# EAGLE design CS-HAT V2 (EAGLE 7.2.0)
REVISION: 1

## Sheet 1 of 4
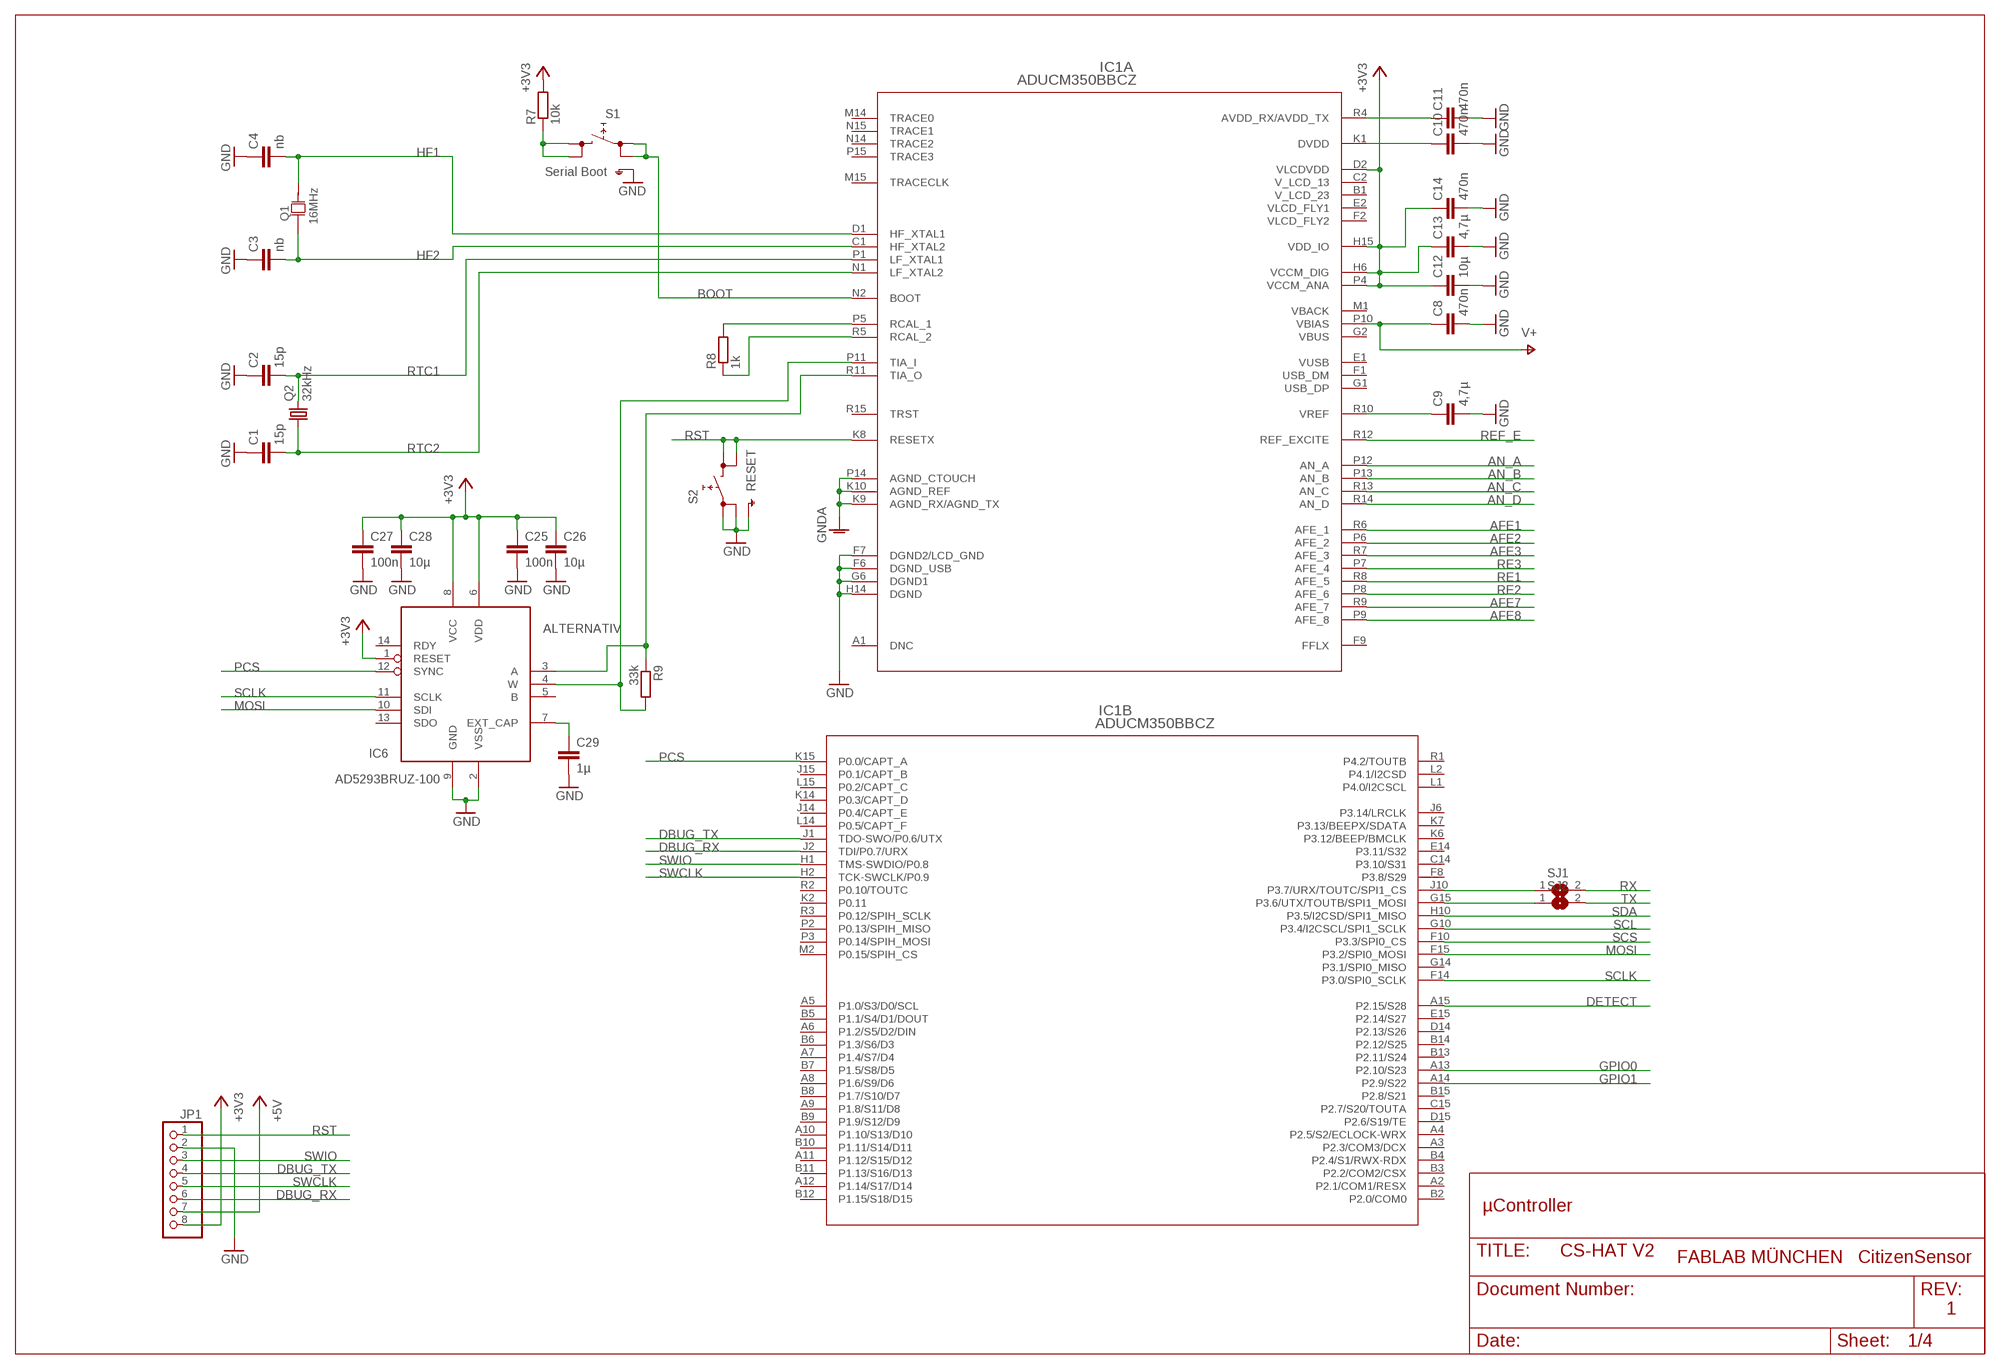
[diagram p0: schematic, sheet 1]

### Parts
C1  15p  C-EUC0805  [C0805]
C2  15p  C-EUC0805  [C0805]
C3  nb  C-EUC0805  [C0805]
C4  nb  C-EUC0805  [C0805]
C8  470n  C-EUC0805  [C0805]
C9  4,7µ  C-EUC1206  [C1206]
C10  470n  C-EUC0805  [C0805]
C11  470n  C-EUC0805  [C0805]
C12  10µ  C-EUC1206  [C1206]
C13  4,7µ  C-EUC1206  [C1206]
C14  470n  C-EUC0805  [C0805]
C25  100n  C-EUC0805  [C0805]
C26  10µ  C-EUC1206  [C1206]
C27  100n  C-EUC0805  [C0805]
C28  10µ  C-EUC1206  [C1206]
C29  1µ  C-EUC1206  [C1206]
IC1  ADUCM350BBCZ  [BC_120_3]
IC6  AD5293BRUZ-100  AD5293BRUZ  [TSSOP14]
JP1  PINHD-1X8S  [1X08S]
Q1  16MHz  JXS53  [JXS53]
Q2  32kHz  FC-12M  [FC-12M]
R7  10k  R-EU_R0805  [R0805]
R8  1k  R-EU_R0805  [R0805]
R9  33k  R-EU_R0805  [R0805]
S1  Serial Boot  SKHMPSE010  [SKHMPXE010]
S2  RESET  SKHMPSE010  [SKHMPXE010]
SJ1  SJ  [SJ]
SJ2  SJ  [SJ]

### Nets
+3V3: C12.1 C13.1 C14.1 C25.1 C26.1 C27.1 C28.1 IC1.D2(A:VLCDVDD) IC1.H6(A:VCCM_DIG) IC1.H15(A:VDD_IO) IC1.P4(A:VCCM_ANA) IC6.1(RESET) IC6.6(VDD) IC6.8(VCC) JP1.8 R7.2 ; also sheet 2,3
+5V: JP1.7 ; also sheet 2
AFE1: IC1.R6(A:AFE_1) ; also sheet 2
AFE2: IC1.P6(A:AFE_2)
AFE3: IC1.R7(A:AFE_3) ; also sheet 2
AFE7: IC1.R9(A:AFE_7) ; also sheet 3
AFE8: IC1.P9(A:AFE_8) ; also sheet 3
AN_A: IC1.P12(A:AN_A) ; also sheet 3
AN_B: IC1.P13(A:AN_B)
AN_C: IC1.R13(A:AN_C)
AN_D: IC1.R14(A:AN_D) ; also sheet 3
BOOT: IC1.N2(A:BOOT) S1.1(1.1) S1.2(1.2) ; also sheet 2
DBUG_RX: IC1.J2(B:TDI/P0.7/URX) JP1.6
DBUG_TX: IC1.J1(B:TDO-SWO/P0.6/UTX) JP1.4
DETECT: IC1.A15(B:P2.15/S28) ; also sheet 2
GND: C1.1 C2.1 C3.1 C4.1 C8.2 C9.2 C10.2 C11.2 C12.2 C13.2 C14.2 C25.2 C26.2 C27.2 C28.2 C29.2 IC1.F6(A:DGND_USB) IC1.F7(A:DGND2/LCD_GND) IC1.G6(A:DGND1) IC1.H14(A:DGND) IC6.2(VSS) IC6.9(GND) JP1.2 S1.5(SH) S2.1(1.1) S2.2(1.2) S2.5(SH) ; also sheet 2,3
GNDA: IC1.K9(A:AGND_RX/AGND_TX) IC1.K10(A:AGND_REF) IC1.P14(A:AGND_CTOUCH) ; also sheet 2,3
GPIO0: IC1.A13(B:P2.10/S23) ; also sheet 2
GPIO1: IC1.A14(B:P2.9/S22) ; also sheet 2
HF1: C4.2 IC1.D1(A:HF_XTAL1) Q1.3
HF2: C3.2 IC1.C1(A:HF_XTAL2) Q1.1
MOSI: IC1.F15(B:P3.2/SPI0_MOSI) IC6.10(SDI) ; also sheet 3
N$3: IC1.J10(B:P3.7/URX/TOUTC/SPI1_CS) SJ1.1
N$4: IC1.G15(B:P3.6/UTX/TOUTB/SPI1_MOSI) SJ2.1
N$9: R7.1 S1.3(2.1) S1.4(2.2)
N$10: C29.1 IC6.7(EXT_CAP)
N$11: IC1.P5(A:RCAL_1) R8.2
N$12: IC1.R5(A:RCAL_2) R8.1
N$13: IC1.P11(A:TIA_I) IC6.4(W) R9.2
N$14: IC1.R11(A:TIA_O) IC6.3(A) R9.1
N$16: C9.1 IC1.R10(A:VREF)
N$18: C10.1 IC1.K1(A:DVDD)
N$19: C11.1 IC1.R4(A:AVDD_RX/AVDD_TX)
PCS: IC1.K15(B:P0.0/CAPT_A) IC6.12(SYNC)
RE1: IC1.R8(A:AFE_5) ; also sheet 2,3
RE2: IC1.P8(A:AFE_6) ; also sheet 2
RE3: IC1.P7(A:AFE_4) ; also sheet 2
REF_E: IC1.R12(A:REF_EXCITE)
RST: IC1.K8(A:RESETX) JP1.1 S2.3(2.1) S2.4(2.2) ; also sheet 2
RTC1: C2.2 IC1.P1(A:LF_XTAL1) Q2.2
RTC2: C1.2 IC1.N1(A:LF_XTAL2) Q2.1
RX: SJ1.2 ; also sheet 2
SCL: IC1.G10(B:P3.4/I2CSCL/SPI1_SCLK) ; also sheet 2,3
SCLK: IC1.F14(B:P3.0/SPI0_SCLK) IC6.11(SCLK) ; also sheet 3
SCS: IC1.F10(B:P3.3/SPI0_CS) ; also sheet 3
SDA: IC1.H10(B:P3.5/I2CSD/SPI1_MISO) ; also sheet 2,3
SWCLK: IC1.H2(B:TCK-SWCLK/P0.9) JP1.5
SWIO: IC1.H1(B:TMS-SWDIO/P0.8) JP1.3
TX: SJ2.2 ; also sheet 2
V+: C8.1 IC1.P10(A:VBIAS) ; also sheet 3
Unconnected: IC1.A1(A:DNC) IC1.A2(B:P2.1/COM1/RESX) IC1.A3(B:P2.3/COM3/DCX) IC1.A4(B:P2.5/S2/ECLOCK-WRX) IC1.A5(B:P1.0/S3/D0/SCL) IC1.A6(B:P1.2/S5/D2/DIN) IC1.A7(B:P1.4/S7/D4) IC1.A8(B:P1.6/S9/D6) IC1.A9(B:P1.8/S11/D8) IC1.A10(B:P1.10/S13/D10) IC1.A11(B:P1.12/S15/D12) IC1.A12(B:P1.14/S17/D14) IC1.B1(A:V_LCD_23) IC1.B2(B:P2.0/COM0) IC1.B3(B:P2.2/COM2/CSX) IC1.B4(B:P2.4/S1/RWX-RDX) IC1.B5(B:P1.1/S4/D1/DOUT) IC1.B6(B:P1.3/S6/D3) IC1.B7(B:P1.5/S8/D5) IC1.B8(B:P1.7/S10/D7) IC1.B9(B:P1.9/S12/D9) IC1.B10(B:P1.11/S14/D11) IC1.B11(B:P1.13/S16/D13) IC1.B12(B:P1.15/S18/D15) IC1.B13(B:P2.11/S24) IC1.B14(B:P2.12/S25) IC1.B15(B:P2.8/S21) IC1.C2(A:V_LCD_13) IC1.C14(B:P3.10/S31) IC1.C15(B:P2.7/S20/TOUTA) IC1.D14(B:P2.13/S26) IC1.D15(B:P2.6/S19/TE) IC1.E1(A:VUSB) IC1.E2(A:VLCD_FLY1) IC1.E14(B:P3.11/S32) IC1.E15(B:P2.14/S27) IC1.F1(A:USB_DM) IC1.F2(A:VLCD_FLY2) IC1.F8(B:P3.8/S29) IC1.F9(A:FFLX) IC1.G1(A:USB_DP) IC1.G2(A:VBUS) IC1.G14(B:P3.1/SPI0_MISO) IC1.J6(B:P3.14/LRCLK) IC1.J14(B:P0.4/CAPT_E) IC1.J15(B:P0.1/CAPT_B) IC1.K2(B:P0.11) IC1.K6(B:P3.12/BEEP/BMCLK) IC1.K7(B:P3.13/BEEPX/SDATA) IC1.K14(B:P0.3/CAPT_D) IC1.L1(B:P4.0/I2CSCL) IC1.L2(B:P4.1/I2CSD) IC1.L14(B:P0.5/CAPT_F) IC1.L15(B:P0.2/CAPT_C) IC1.M1(A:VBACK) IC1.M2(B:P0.15/SPIH_CS) IC1.M14(A:TRACE0) IC1.M15(A:TRACECLK) IC1.N14(A:TRACE2) IC1.N15(A:TRACE1) IC1.P2(B:P0.13/SPIH_MISO) IC1.P3(B:P0.14/SPIH_MOSI) IC1.P15(A:TRACE3) IC1.R1(B:P4.2/TOUTB) IC1.R2(B:P0.10/TOUTC) IC1.R3(B:P0.12/SPIH_SCLK) IC1.R15(A:TRST) IC6.5(B) IC6.13(SDO) IC6.14(RDY)

### Notes on the sheet
- ALTERNATIV
- µController
- FABLAB MÜNCHEN   CitizenSensor

## Sheet 2 of 4
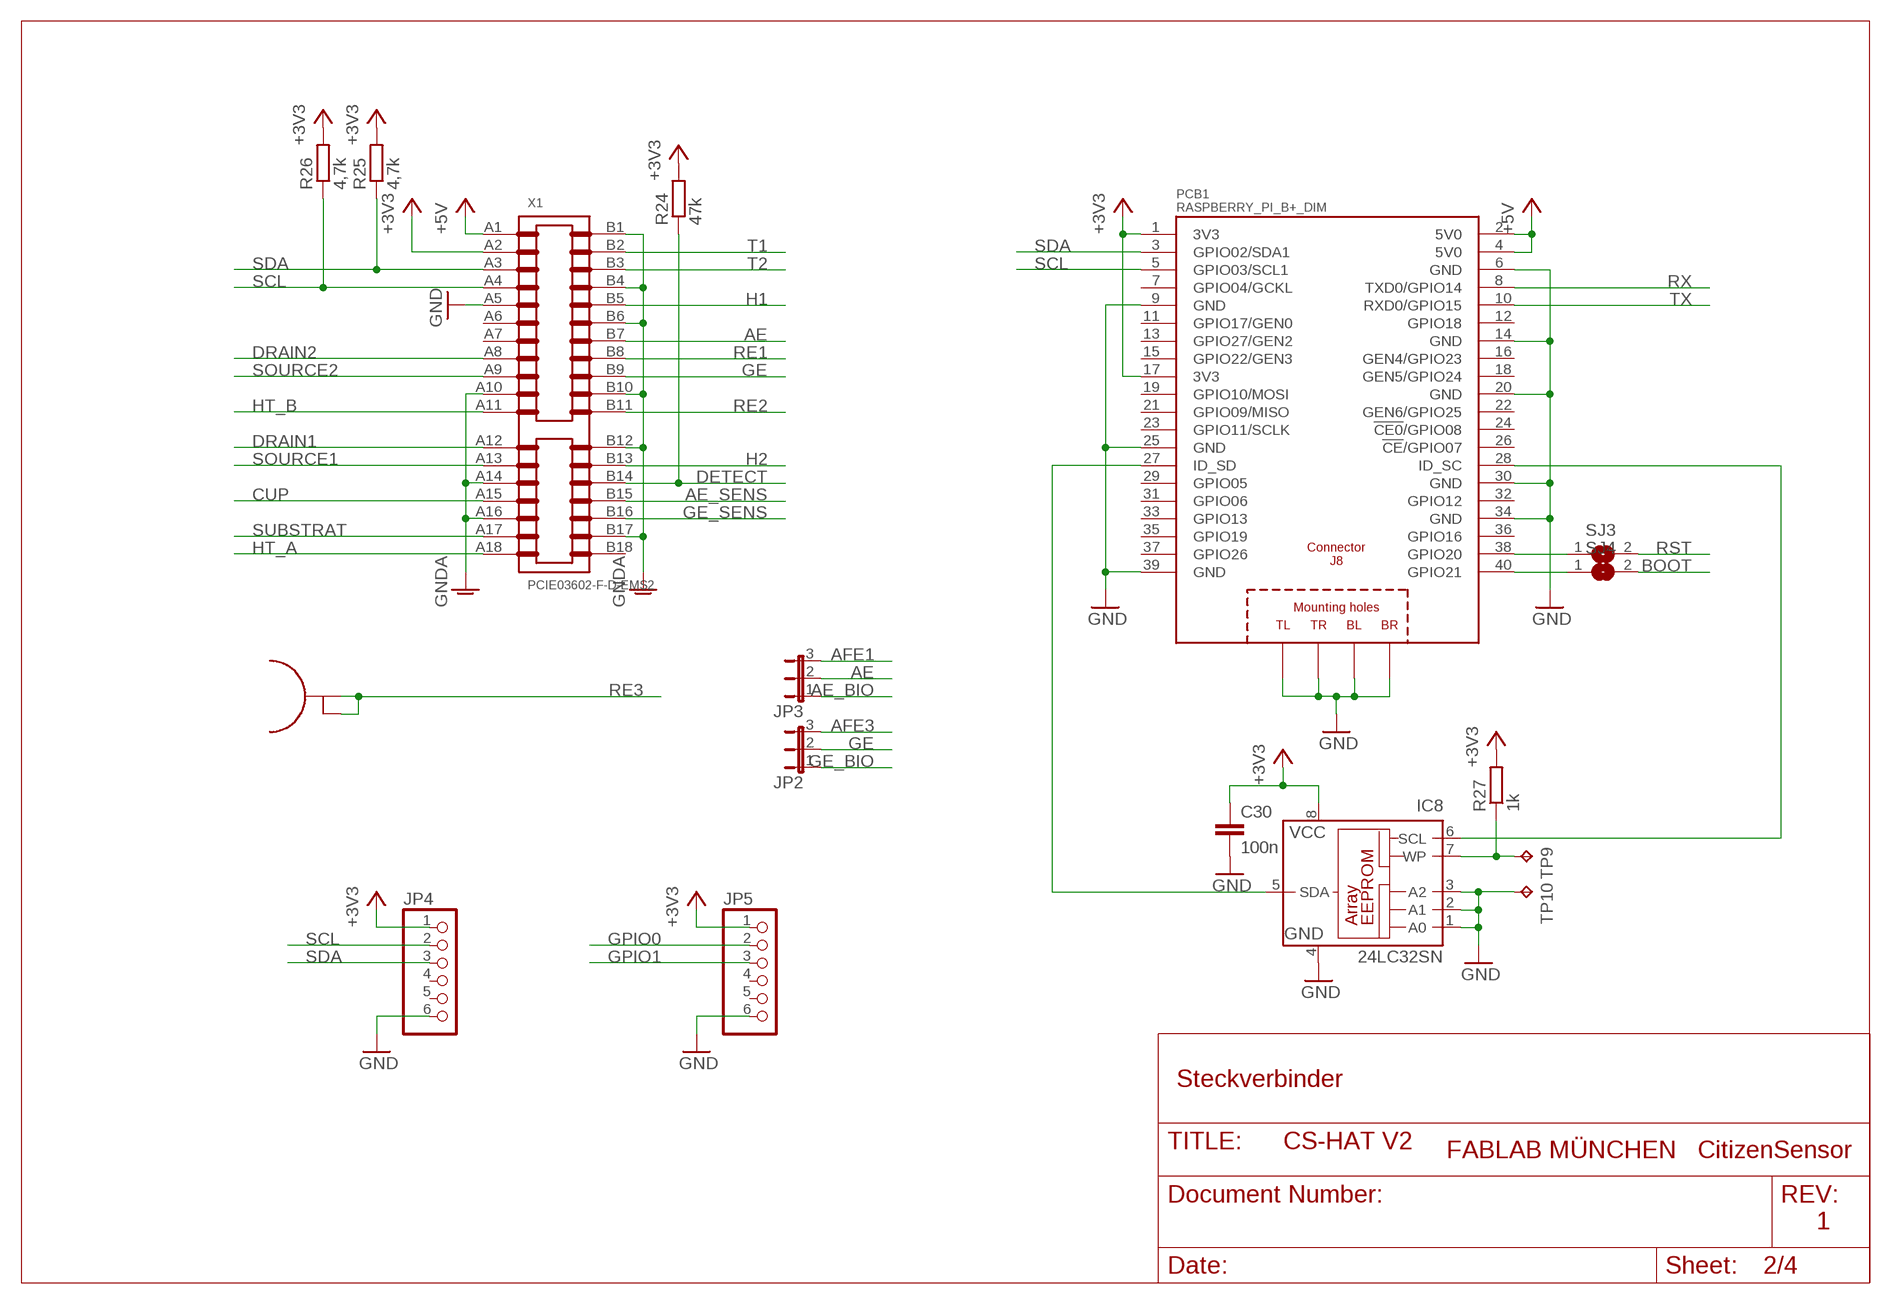
[diagram p1: schematic, sheet 2]

### Parts
C30  100n  C-EUC0805  [C0805]
IC8  24LC32SN  24C04SN  [SO-08]
JP2  JP2ES  [JP2S]
JP3  JP2ES  [JP2S]
JP4  PINHD-1X6S  [1X06S]
JP5  PINHD-1X6S  [1X06S]
PCB1  RASPBERRY_PI_B+_DIM  [RASPBERRY_PI_BPLUS_DIM]
R24  47k  R-EU_R0805  [R0805]
R25  4,7k  R-EU_R0805  [R0805]
R26  4,7k  R-EU_R0805  [R0805]
R27  1k  R-EU_R0805  [R0805]
SJ3  SJ  [SJ]
SJ4  SJ  [SJ]
TP8  TESTPLUG2MM  [TESTPLUG2MM]
TP9  TPB2,54  [B2,54]
TP10  TPB2,54  [B2,54]
X1  PCIE03602-F-D-EMS2  [PCIE-036-02-F-D-EMS2]

### Nets
+3V3: C30.1 IC8.8(VCC) JP4.1 JP5.1 PCB1.1(3V3) PCB1.17(3V3) R24.2 R25.2 R26.2 R27.2 X1.A2 ; also sheet 1,3
+5V: PCB1.2(5V0) PCB1.4(5V0) X1.A1 ; also sheet 1
AE: JP3.2 X1.B7
AE_BIO: JP3.1 ; also sheet 3
AE_SENS: X1.B15 ; also sheet 3
AFE1: JP3.3 ; also sheet 1
AFE3: JP2.3 ; also sheet 1
BOOT: SJ4.2 ; also sheet 1
CUP: X1.A15
DETECT: R24.1 X1.B14 ; also sheet 1
DRAIN1: X1.A12
DRAIN2: X1.A8
GE: JP2.2 X1.B9
GE_BIO: JP2.1 ; also sheet 3
GE_SENS: X1.B16 ; also sheet 3
GND: C30.2 IC8.1(A0) IC8.2(A1) IC8.3(A2) IC8.4(GND) JP4.6 JP5.6 PCB1.6(GND) PCB1.9(GND) PCB1.14(GND) PCB1.20(GND) PCB1.25(GND) PCB1.30(GND) PCB1.34(GND) PCB1.39(GND) PCB1.PE_BL(BL) PCB1.PE_BR(BR) PCB1.PE_TL(TL) PCB1.PE_TR(TR) TP10.TP X1.A5 ; also sheet 1,3
GNDA: X1.A10 X1.A14 X1.A16 X1.B1 X1.B4 X1.B6 X1.B10 X1.B12 X1.B17 ; also sheet 1,3
GPIO0: JP5.2 ; also sheet 1
GPIO1: JP5.3 ; also sheet 1
H1: X1.B5 ; also sheet 3
H2: X1.B13
HT_A: X1.A18
HT_B: X1.A11
N$25: PCB1.40(GPIO21) SJ4.1
N$28: PCB1.38(GPIO20) SJ3.1
N$31: IC8.5(SDA) PCB1.27(ID_SD)
N$32: IC8.6(SCL) PCB1.28(ID_SC)
N$33: IC8.7(WP) R27.1 TP9.TP
RE1: X1.B8 ; also sheet 1,3
RE2: X1.B11 ; also sheet 1
RE3: TP8.A TP8.B ; also sheet 1
RST: SJ3.2 ; also sheet 1
RX: PCB1.8(TXD0/GPIO14) ; also sheet 1
SCL: JP4.2 PCB1.5(GPIO03/SCL1) R26.1 X1.A4 ; also sheet 1,3
SDA: JP4.3 PCB1.3(GPIO02/SDA1) R25.1 X1.A3 ; also sheet 1,3
SOURCE1: X1.A13
SOURCE2: X1.A9
SUBSTRAT: X1.A17
T1: X1.B2 ; also sheet 3
T2: X1.B3 ; also sheet 3
TX: PCB1.10(RXD0/GPIO15) ; also sheet 1
Unconnected: JP4.4 JP4.5 JP5.4 JP5.5 PCB1.7(GPIO04/GCKL) PCB1.11(GPIO17/GEN0) PCB1.12(GPIO18) PCB1.13(GPIO27/GEN2) PCB1.15(GPIO22/GEN3) PCB1.16(GEN4/GPIO23) PCB1.18(GEN5/GPIO24) PCB1.19(GPIO10/MOSI) PCB1.21(GPIO09/MISO) PCB1.22(GEN6/GPIO25) PCB1.23(GPIO11/SCLK) PCB1.24(!CE0!/GPIO08) PCB1.26(!CE!/GPIO07) PCB1.29(GPIO05) PCB1.31(GPIO06) PCB1.32(GPIO12) PCB1.33(GPIO13) PCB1.35(GPIO19) PCB1.36(GPIO16) PCB1.37(GPIO26) X1.A6 X1.A7 X1.B18

### Notes on the sheet
- Steckverbinder
- FABLAB MÜNCHEN   CitizenSensor

## Sheet 3 of 4
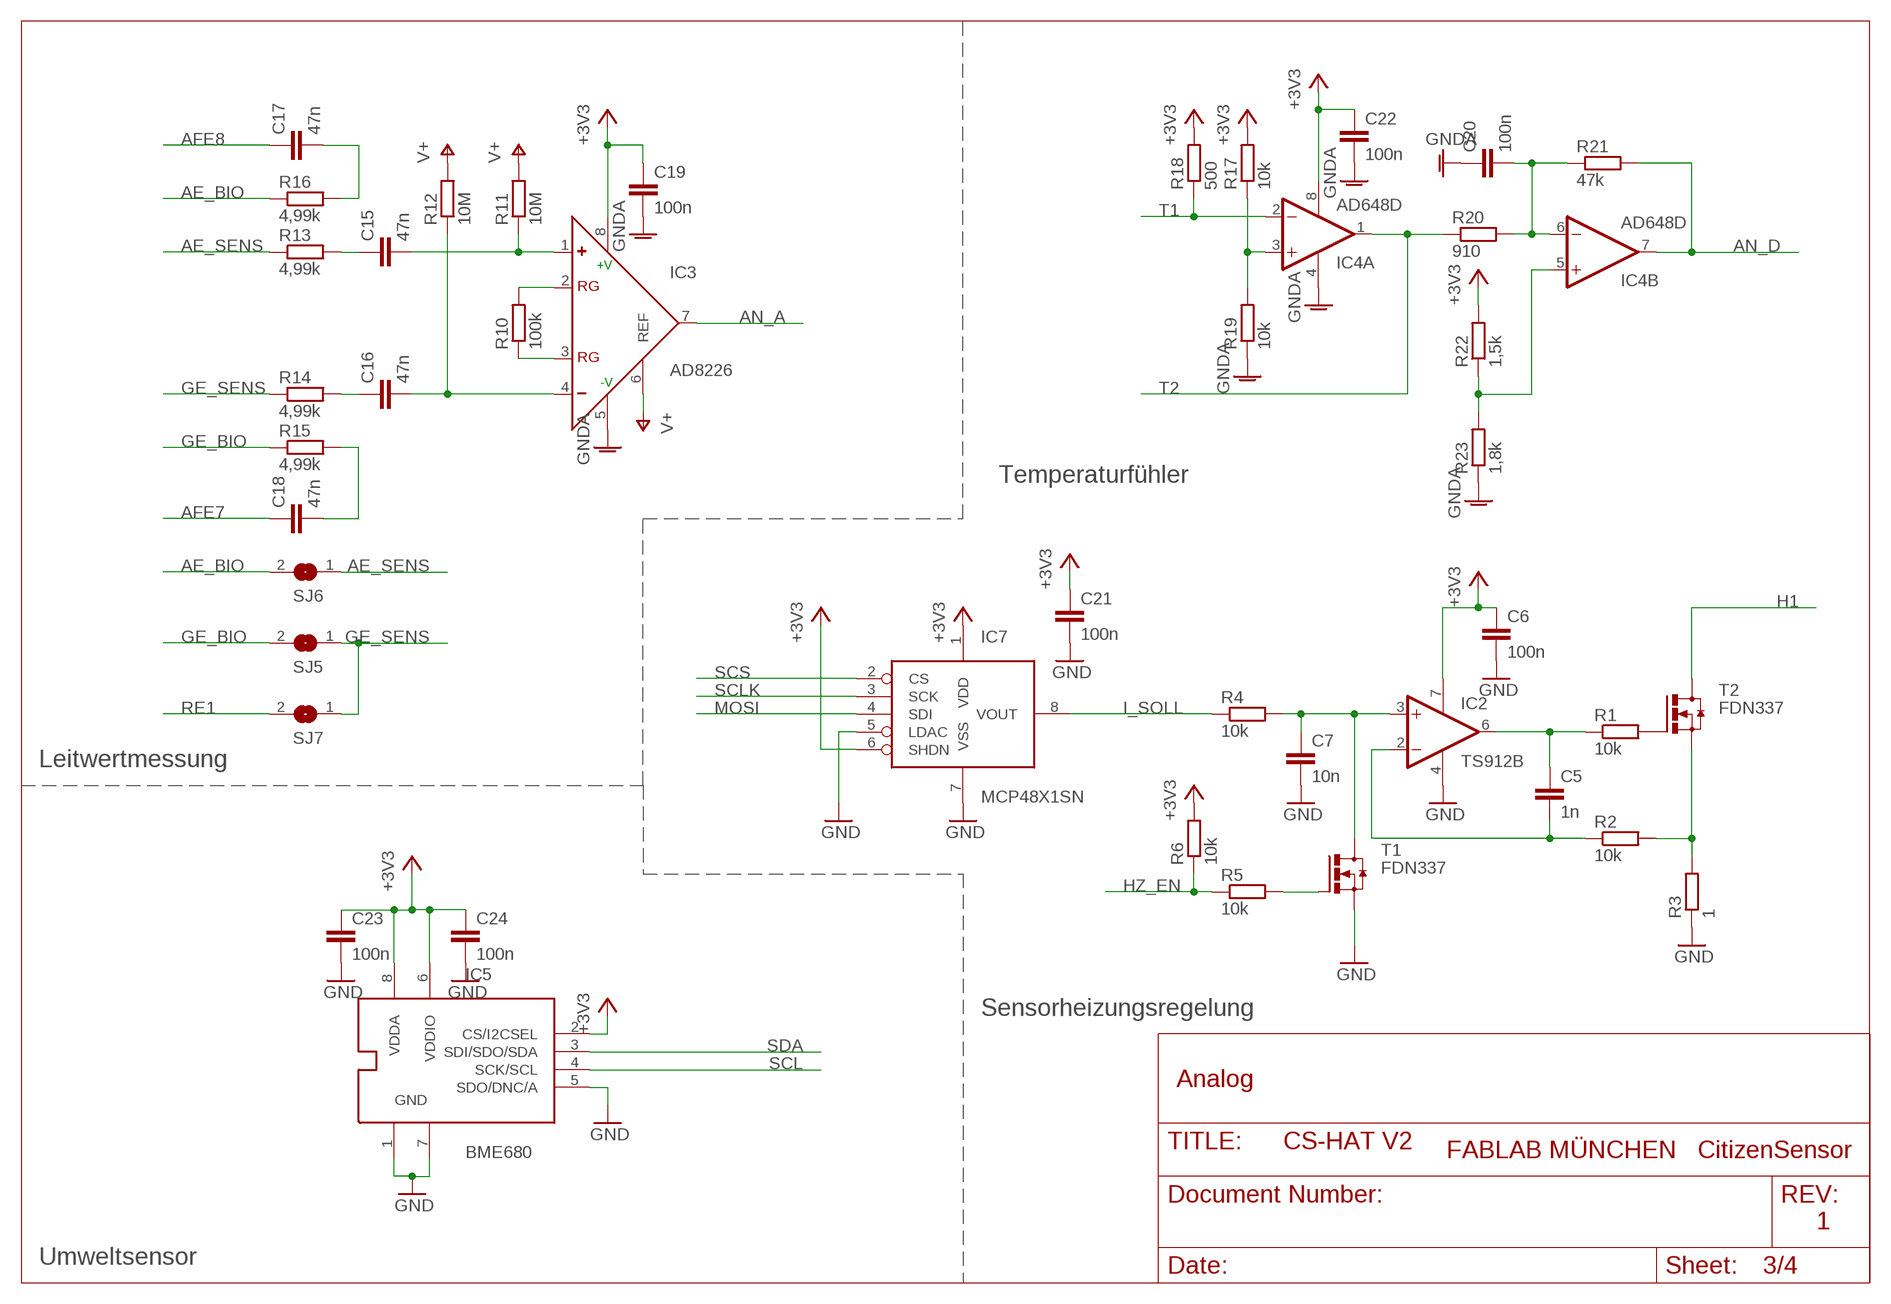
[diagram p2: schematic, sheet 3]

### Parts
C5  1n  C-EUC0805  [C0805]
C6  100n  C-EUC0805  [C0805]
C7  10n  C-EUC0805  [C0805]
C15  47n  C-EUC0805  [C0805]
C16  47n  C-EUC0805  [C0805]
C17  47n  C-EUC0805  [C0805]
C18  47n  C-EUC0805  [C0805]
C19  100n  C-EUC0805  [C0805]
C20  100n  C-EUC0805  [C0805]
C21  100n  C-EUC0805  [C0805]
C22  100n  C-EUC0805  [C0805]
C23  100n  C-EUC0805  [C0805]
C24  100n  C-EUC0805  [C0805]
IC2  TS912B  1AMP_P7+4D  [SO08]
IC3  AD8226  [SO8]
IC4  AD648D  [SO08]
IC5  BME680  [BME680]
IC7  MCP48X1SN  [SO-08]
R1  10k  R-EU_R0805  [R0805]
R2  10k  R-EU_R0805  [R0805]
R3  1  R-EU_R1210  [R1210]
R4  10k  R-EU_R0805  [R0805]
R5  10k  R-EU_R0805  [R0805]
R6  10k  R-EU_R0805  [R0805]
R10  100k  R-EU_R0805  [R0805]
R11  10M  R-EU_R0805  [R0805]
R12  10M  R-EU_R0805  [R0805]
R13  4,99k  R-EU_R0805  [R0805]
R14  4,99k  R-EU_R0805  [R0805]
R15  4,99k  R-EU_R0805  [R0805]
R16  4,99k  R-EU_R0805  [R0805]
R17  10k  R-EU_R0805  [R0805]
R18  500  R-EU_R0805  [R0805]
R19  10k  R-EU_R0805  [R0805]
R20  910  R-EU_R0805  [R0805]
R21  47k  R-EU_R0805  [R0805]
R22  1,5k  R-EU_R0805  [R0805]
R23  1,8k  R-EU_R0805  [R0805]
SJ5  SJ  [SJ]
SJ6  SJ  [SJ]
SJ7  SJ  [SJ]
T1  FDN337  [SUPER-SOT3]
T2  FDN337  [SUPER-SOT3]

### Nets
+3V3: C6.1 C19.1 C21.1 C22.1 C23.1 C24.1 IC2.7(V+) IC3.8(+V) IC4.8(P:V+) IC5.2(CS/I2CSEL) IC5.6(VDDIO) IC5.8(VDDA) IC7.1(VDD) IC7.6(SHDN) R6.2 R17.2 R18.2 R22.2 ; also sheet 1,2
AE_BIO: R16.1 SJ6.2 ; also sheet 2
AE_SENS: R13.1 SJ6.1 ; also sheet 2
AFE7: C18.1 ; also sheet 1
AFE8: C17.1 ; also sheet 1
AN_A: IC3.7(OUT) ; also sheet 1
AN_D: IC4.7(B:OUT) R21.2 ; also sheet 1
GE_BIO: R15.1 SJ5.2 ; also sheet 2
GE_SENS: R14.1 SJ5.1 SJ7.1 ; also sheet 2
GND: C6.2 C7.2 C21.2 C23.2 C24.2 IC2.4(V-) IC5.1(GND) IC5.5(SDO/DNC/A) IC5.7(GND) IC7.5(LDAC) IC7.7(VSS) R3.1 T1.2(S) ; also sheet 1,2
GNDA: C19.2 C20.1 C22.2 IC3.5(-V) IC4.4(P:V-) R19.1 R23.1 ; also sheet 1,2
H1: T2.3(D) ; also sheet 2
HZ_EN: R5.1 R6.1
I_SOLL: IC7.8(VOUT) R4.1
MOSI: IC7.4(SDI) ; also sheet 1
N$1: C5.1 IC2.6(OUT) R1.1
N$2: C5.2 IC2.2(-IN) R2.1
N$5: R1.2 T2.1(G)
N$6: R2.2 R3.2 T2.2(S)
N$7: C7.1 IC2.3(+IN) R4.2 T1.3(D)
N$8: R5.2 T1.1(G)
N$15: IC3.2(RG) R10.2
N$17: C18.2 R15.2
N$20: IC3.3(RG) R10.1
N$21: C15.2 IC3.1(+) R11.1
N$22: C16.2 IC3.4(-) R12.1
N$23: C16.1 R14.2
N$24: C15.1 R13.2
N$26: C17.2 R16.2
N$27: IC4.3(A:+IN) R17.1 R19.2
N$29: C20.2 IC4.6(B:-IN) R20.2 R21.1
N$30: IC4.5(B:+IN) R22.1 R23.2
RE1: SJ7.2 ; also sheet 1,2
SCL: IC5.4(SCK/SCL) ; also sheet 1,2
SCLK: IC7.3(SCK) ; also sheet 1
SCS: IC7.2(CS) ; also sheet 1
SDA: IC5.3(SDI/SDO/SDA) ; also sheet 1,2
T1: IC4.2(A:-IN) R18.1 ; also sheet 2
T2: IC4.1(A:OUT) R20.1 ; also sheet 2
V+: IC3.6(REF) R11.2 R12.2 ; also sheet 1

### Notes on the sheet
- Temperaturfühler
- Leitwertmessung
- Sensorheizungsregelung
- Analog
- FABLAB MÜNCHEN   CitizenSensor
- Umweltsensor

## Sheet 4 of 4
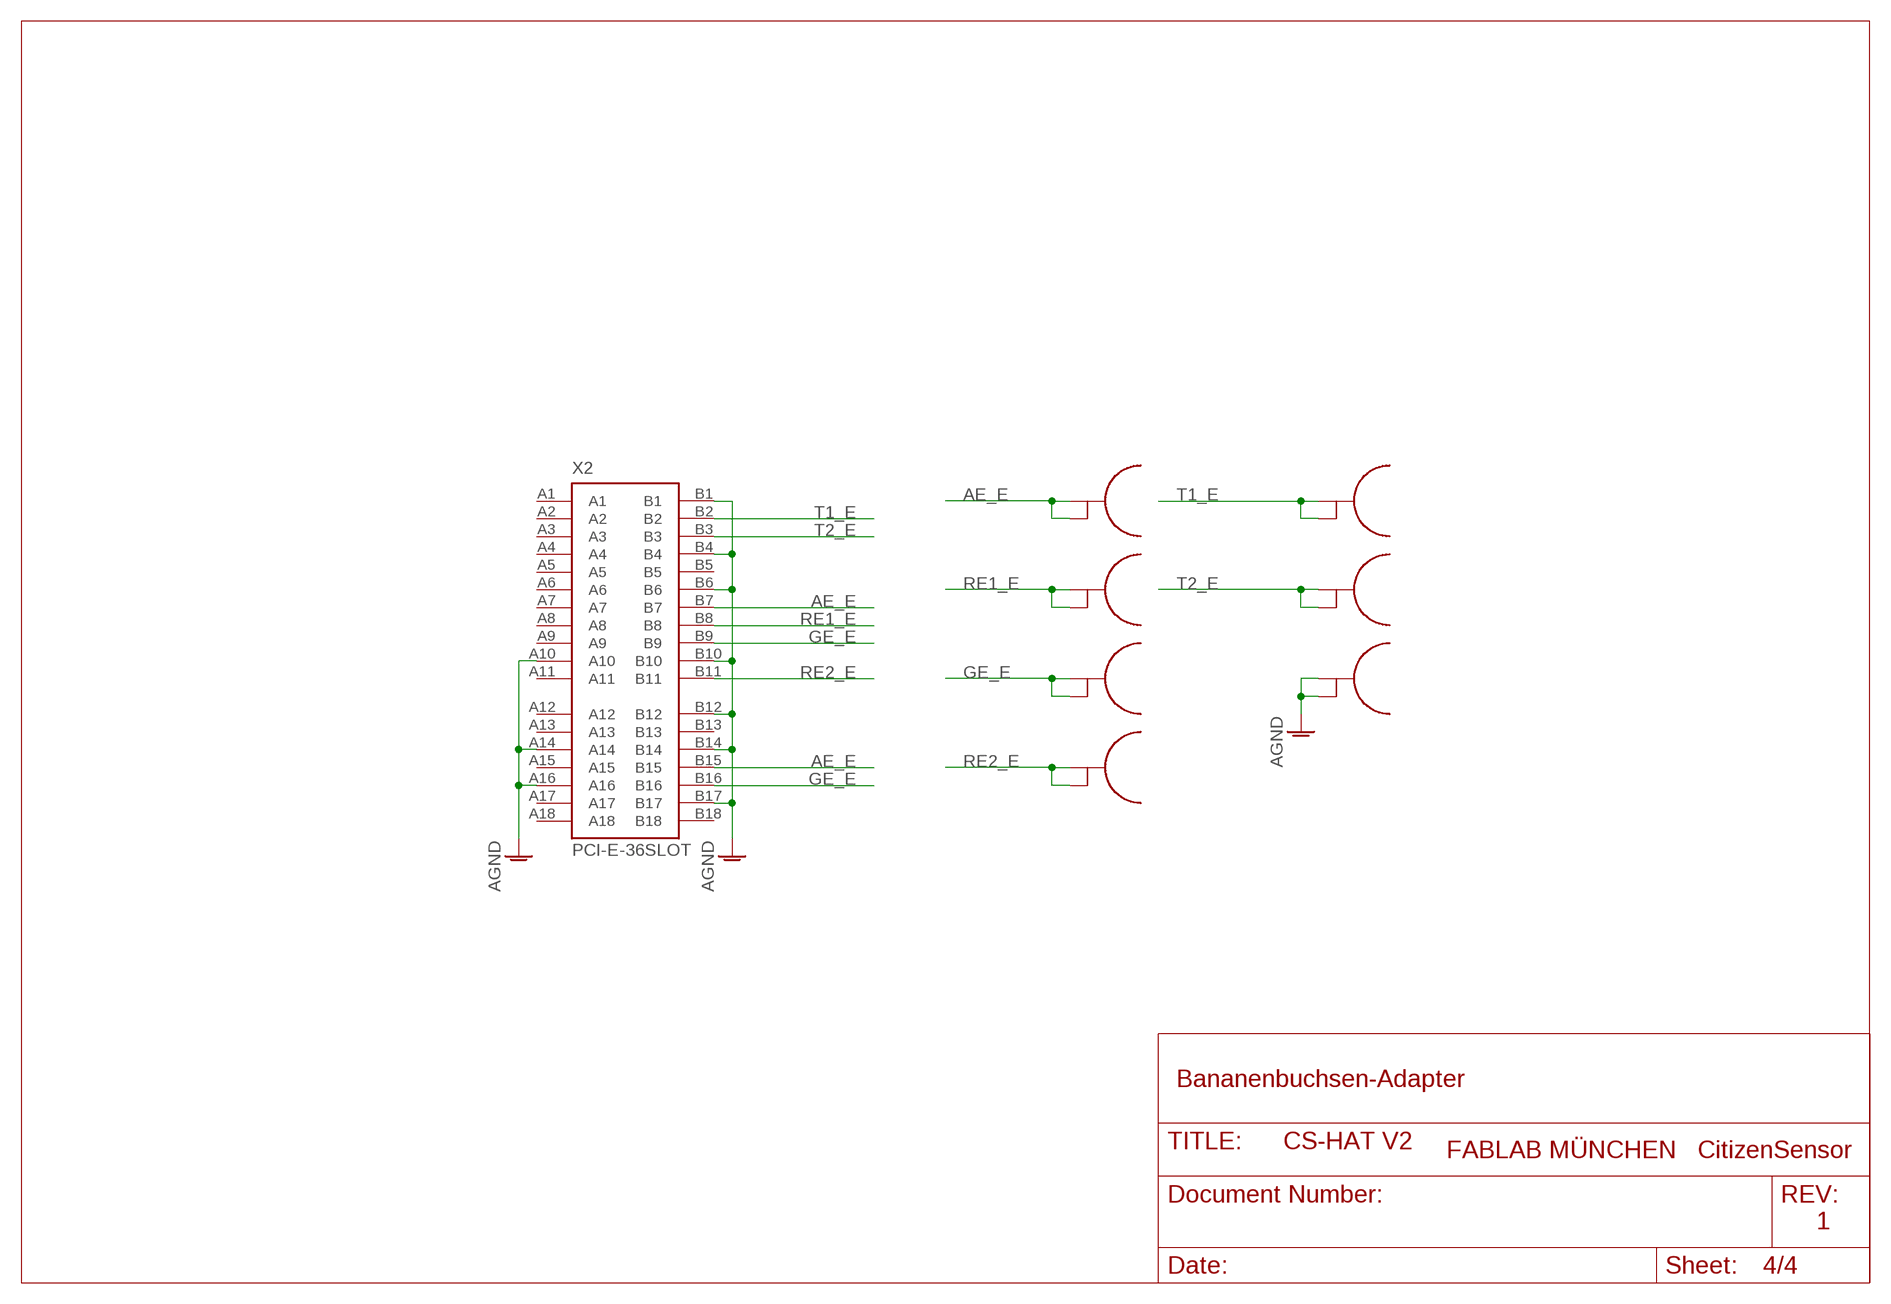
[diagram p3: schematic, sheet 4]

### Parts
TP1  TESTPLUG2MM  [TESTPLUG2MM]
TP2  TESTPLUG2MM  [TESTPLUG2MM]
TP3  TESTPLUG2MM  [TESTPLUG2MM]
TP4  TESTPLUG2MM  [TESTPLUG2MM]
TP5  TESTPLUG2MM  [TESTPLUG2MM]
TP6  TESTPLUG2MM  [TESTPLUG2MM]
TP7  TESTPLUG2MM  [TESTPLUG2MM]
X2  PCI-E-36SLOT  [PCI-E-36_SLOT]

### Nets
AE_E: TP1.A TP1.B X2.B7 X2.B15
AGND: TP7.A TP7.B X2.A10 X2.A14 X2.A16 X2.B1 X2.B4 X2.B6 X2.B10 X2.B12 X2.B14 X2.B17
GE_E: TP3.A TP3.B X2.B9 X2.B16
RE1_E: TP2.A TP2.B X2.B8
RE2_E: TP4.A TP4.B X2.B11
T1_E: TP5.A TP5.B X2.B2
T2_E: TP6.A TP6.B X2.B3
Unconnected: X2.A1 X2.A2 X2.A3 X2.A4 X2.A5 X2.A6 X2.A7 X2.A8 X2.A9 X2.A11 X2.A12 X2.A13 X2.A15 X2.A17 X2.A18 X2.B5 X2.B13 X2.B18

### Notes on the sheet
- Bananenbuchsen-Adapter
- FABLAB MÜNCHEN   CitizenSensor

## Library data of the parts
C1-C30 = rcl:C-EU: CAPACITOR, European symbol
IC1 = analog-devices:ADUCM350BBCZ
IC2 = linear:1AMP_P7+4: OP AMP
IC3 = analog-devices:AD8226
IC4 = linear:AD648: OP AMP
IC5 = bosch:BME680: Low power gas, pressure, temperature & humidity sensor
IC6 = analog-devices:AD5293: Single-Channel, 1024-Position, 1% R-Tolerance Digital Potentiometer
IC7 = microchip:MCP48X1
IC8 = microchip:24C*: Serial EEPROM 1 K/2 K/4 K; MPN: M24C04-WMN6P; OC_FARNELL: 9882812; OC_NEWARK: 83K1376
JP1 = pinhead:PINHD-1X8: PIN HEADER
JP2 JP3 = jumper:JP2E: JUMPER
JP4 JP5 = pinhead:PINHD-1X6: PIN HEADER
PCB1 = RASPBERRY_PI_Bplus:RASPBERRY_PI_B+: Raspberry Pi B+ Basedon issue: Thursday, July 10, 2014 - Rev 1.2 LBR by Tim Rettmann 07-2014
Q1 = SMD_QUARZ:JXS53: Jauch XJS53 Quarz 4 Pad Version · 5.0 x 3.2 mm Ho, 31.08.2007 Ho, 09.01.2013 ID und Frequenz entfernt
Q2 = crystal:FC-12M: kHz RANGE CRYSTAL UNIT LOW PROFILE SMD Source: Epson Toyocom FC-12M.pdf
R1-R27 = rcl:R-EU_: RESISTOR, European symbol
S1 S2 = switch:SKHMP*E010: 6.2 X 6.5mm TACT Switch (SMD) Source: http://www3.alps.co.jp/WebObjects/catalog.woa/PDF/E/Switch/Tact/SKHM/SKHM.PDF
SJ1-SJ7 = jumper:SJ: SMD solder JUMPER
T1 T2 = transistor-power:FDN337: N-Channel Logic Level MOSFET
TP1-TP8 = special:TESTPLUG: Testbuchse 2mm Farnell: 2292857 schwarz 1307228 rot 1307241 blau 1307216 grün 1307186 weiß 1654712 gelb
TP9 TP10 = testpad:TP: Test pad
X1 = con-samtec:PCIE036
X2 = con-pc:PCI-E-36

## Board
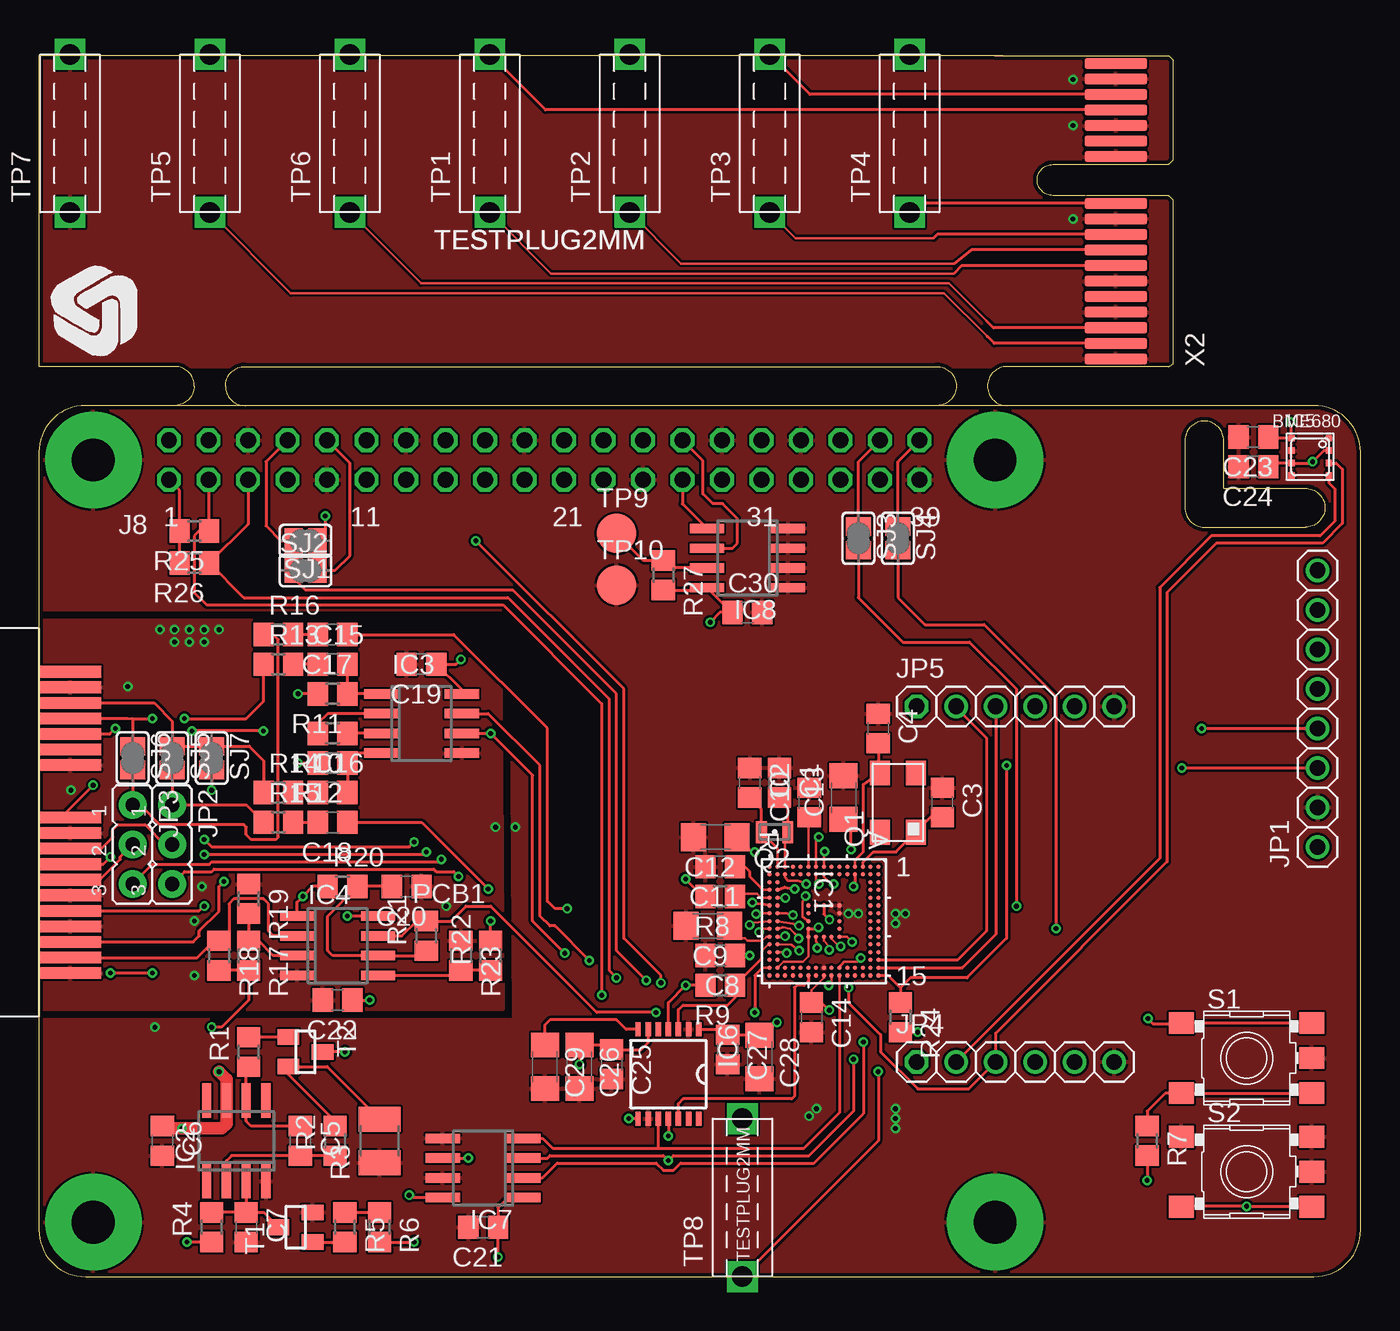
[diagram p4: board, top side]
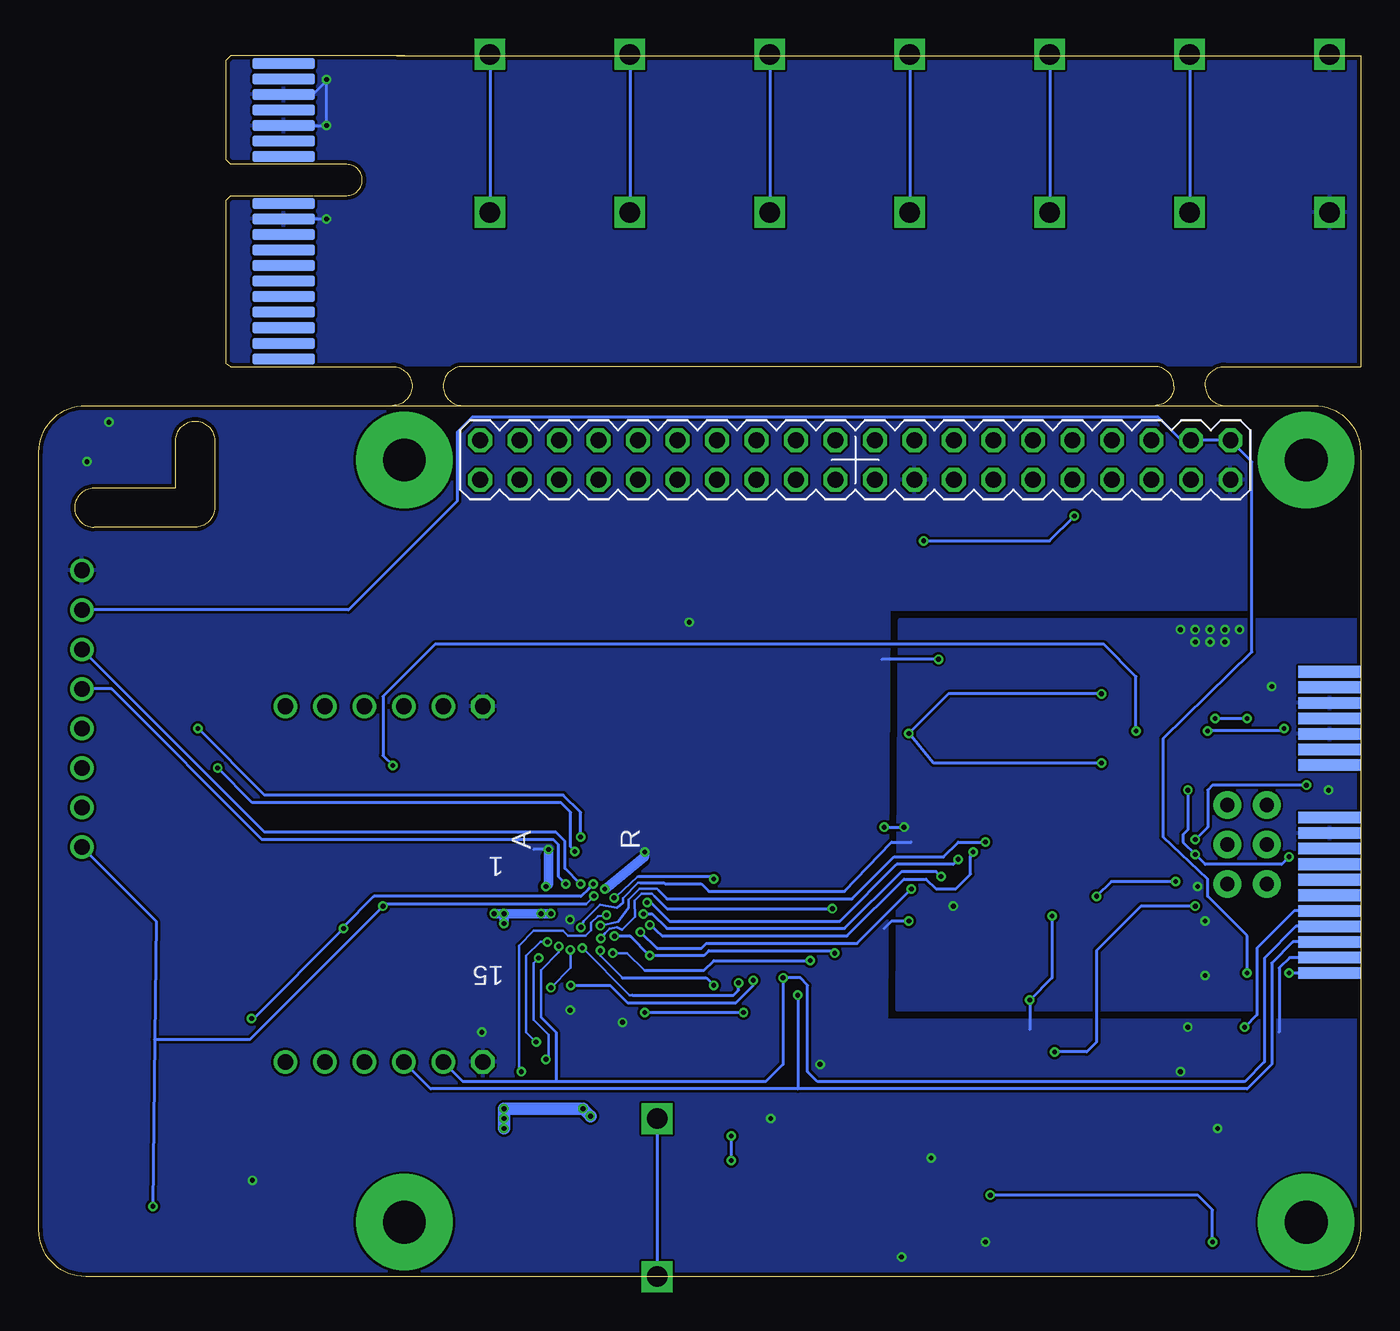
[diagram p5: board, bottom side, seen from below]

Size 85 x 78.5 mm. Coordinates in mm from the lower left corner, seen from the top.
Outline: 62,78.5 0,78.5 0,58.5 8.75,58.5 arc-90 10,57.25 arc-90 8.65,56
Outline: 68,58.5 62.25,58.5 arc90 61,57.25 arc90 62.25,56
Outline: 13.25,56 arc-90 12,57.25 arc-90 13.25,58.5 57.75,58.5 arc-90 59,57.25 arc-90 57.75,56
Outline: 76.2,50.68 81.45,50.68 arc-90 82.7,49.43 arc-90 81.45,48.18 74.95,48.18 arc-90 73.7,49.43 73.7,53.75 arc-90 74.95,55 arc-90 76.2,53.75 76.2,50.68
Copper layers (1*16): Top 0.035mm / dielectric 1.5mm / Bottom 0.035mm
Design rules "default *": minimum track width 6mil, minimum drill 10mil, track to track 6mil, track to pad 6mil, pad to pad 6mil, via to via 6mil, smd to smd 0mil, copper to edge 10mil, drill to drill 8mil, minimum pad ring 10mil, minimum via ring 6mil, stop-mask expansion 4mil, vias tented up to drill 0mil, thermal gap 6mil
bRestrict: 3 lines

### Footprints (pad centres in the part's own frame; a part is rotated, then mirrored left to right if it is on the bottom)
C0805 = smd 1.3 x 1.5: 1 -0.95,0; 2 0.95,0
C1206 = smd 1.6 x 1.8: 1 -1.4,0; 2 1.4,0
BC_120_3 = smd 0.305 x 0.305: A1 -3.5,3.5; A2 -3,3.5; A3 -2.5,3.5; A4 -2,3.5; A5 -1.5,3.5; A6 -1,3.5; A7 -0.5,3.5; A8 0,3.5; A9 0.5,3.5; A10 1,3.5; A11 1.5,3.5; A12 2,3.5; A13 2.5,3.5; A14 3,3.5; A15 3.5,3.5; B1 -3.5,3; B2 -3,3; B3 -2.5,3; B4 -2,3; B5 -1.5,3; B6 -1,3; B7 -0.5,3; B8 0,3; B9 0.5,3; B10 1,3; B11 1.5,3; B12 2,3; B13 2.5,3; B14 3,3; B15 3.5,3; C1 -3.5,2.5; C2 -3,2.5; C14 3,2.5; C15 3.5,2.5; D1 -3.5,2; D2 -3,2; D14 3,2; D15 3.5,2; E1 -3.5,1.5; E2 -3,1.5; E14 3,1.5; E15 3.5,1.5; F1 -3.5,1; F2 -3,1; F6 -1,1; F7 -0.5,1; F8 0,1; F9 0.5,1; F10 1,1; F14 3,1; F15 3.5,1; G1 -3.5,0.5; G2 -3,0.5; G6 -1,0.5; G10 1,0.5; G14 3,0.5; G15 3.5,0.5; H1 -3.5,0; H2 -3,0; H6 -1,0; H10 1,0; H14 3,0; H15 3.5,0; J1 -3.5,-0.5; J2 -3,-0.5; J6 -1,-0.5; J10 1,-0.5; J14 3,-0.5; J15 3.5,-0.5; K1 -3.5,-1; K2 -3,-1; K6 -1,-1; K7 -0.5,-1; K8 0,-1; K9 0.5,-1; K10 1,-1; K14 3,-1; K15 3.5,-1; L1 -3.5,-1.5; L2 -3,-1.5; L14 3,-1.5; L15 3.5,-1.5; M1 -3.5,-2; M2 -3,-2; M14 3,-2; M15 3.5,-2; N1 -3.5,-2.5; N2 -3,-2.5; N14 3,-2.5; N15 3.5,-2.5; P1 -3.5,-3; P2 -3,-3; P3 -2.5,-3; P4 -2,-3; P5 -1.5,-3; P6 -1,-3; P7 -0.5,-3; P8 0,-3; P9 0.5,-3; P10 1,-3; P11 1.5,-3; P12 2,-3; P13 2.5,-3; P14 3,-3; P15 3.5,-3; R1 -3.5,-3.5; R2 -3,-3.5; R3 -2.5,-3.5; R4 -2,-3.5; R5 -1.5,-3.5; R6 -1,-3.5; R7 -0.5,-3.5; R8 0,-3.5; R9 0.5,-3.5; R10 1,-3.5; R11 1.5,-3.5; R12 2,-3.5; R13 2.5,-3.5; R14 3,-3.5; R15 3.5,-3.5
SO08 = smd 0.6 x 2.2: 1 -1.905,-2.6; 2 -0.635,-2.6; 3 0.635,-2.6; 4 1.905,-2.6; 5 1.905,2.6; 6 0.635,2.6; 7 -0.635,2.6; 8 -1.905,2.6
SO8 = smd 0.6 x 2.2: 1 -1.905,-2.6; 2 -0.635,-2.6; 3 0.635,-2.6; 4 1.905,-2.6; 5 1.905,2.6; 6 0.635,2.6; 7 -0.635,2.6; 8 -1.905,2.6
BME680 = smd 0.4 x 0.4: 1 1.2,1.2; 2 1.2,0.4; 3 1.2,-0.4; 4 1.2,-1.2; 5 -1.2,-1.2; 6 -1.2,-0.4; 7 -1.2,0.4; 8 -1.2,1.2
TSSOP14 = smd 0.9 x 0.35: 1 -2.875,1.95; 2 -2.875,1.3; 3 -2.875,0.65; 4 -2.875,0; 5 -2.875,-0.65; 6 -2.875,-1.3; 7 -2.875,-1.95; 8 2.875,-1.95; 9 2.875,-1.3; 10 2.875,-0.65; 11 2.875,0; 12 2.875,0.65; 13 2.875,1.3; 14 2.875,1.95
SO-08 = smd 0.6 x 2.2: 1 -1.905,-2.6; 2 -0.635,-2.6; 3 0.635,-2.6; 4 1.905,-2.6; 5 1.905,2.6; 6 0.635,2.6; 7 -0.635,2.6; 8 -1.905,2.6
1X08S = drill 1.016: 1 -8.89,0; 2 -6.35,0; 3 -3.81,0; 4 -1.27,0; 5 1.27,0; 6 3.81,0; 7 6.35,0; 8 8.89,0
JP2S = drill 0.914 pad 1.778: 1 -2.54,0; 2 0,0; 3 2.54,0
1X06S = drill 1.016 octagon: 1 -6.35,0 | drill 1.016: 2 -3.81,0; 3 -1.27,0; 4 1.27,0; 5 3.81,0; 6 6.35,0
RASPBERRY_PI_BPLUS_DIM = drill 1.016 octagon: 1 8.37,51.23; 2 8.37,53.77; 3 10.91,51.23; 4 10.91,53.77; 5 13.45,51.23; 6 13.45,53.77; 7 15.99,51.23; 8 15.99,53.77; 9 18.53,51.23; 10 18.53,53.77; 11 21.07,51.23; 12 21.07,53.77; 13 23.61,51.23; 14 23.61,53.77; 15 26.15,51.23; 16 26.15,53.77; 17 28.69,51.23; 18 28.69,53.77; 19 31.23,51.23; 20 31.23,53.77; 21 33.77,51.23; 22 33.77,53.77; 23 36.31,51.23; 24 36.31,53.77; 25 38.85,51.23; 26 38.85,53.77; 27 41.39,51.23; 28 41.39,53.77; 29 43.93,51.23; 30 43.93,53.77; 31 46.47,51.23; 32 46.47,53.77; 33 49.01,51.23; 34 49.01,53.77; 35 51.55,51.23; 36 51.55,53.77; 37 54.09,51.23; 38 54.09,53.77; 39 56.63,51.23; 40 56.63,53.77 | drill 2.75 pad 6.2: PE_BL 3.5,3.5; PE_BR 61.5,3.5; PE_TL 3.5,52.5; PE_TR 61.5,52.5
JXS53 = smd 1.6 x 1.3: 1 -1.9,-1.15; 2 1.9,-1.15; 3 1.9,1.15; 4 -1.9,1.15
FC-12M = smd 0.7 x 1.4: 1 -0.85,0; 2 0.85,0
R0805 = smd 1.3 x 1.5: 1 -0.95,0; 2 0.95,0
R1210 = smd 1.6 x 2.7: 1 -1.4,0; 2 1.4,0
SKHMPXE010 = smd 1.6 x 1.4: 1 -4.2,2.25; 2 4.2,2.25; 3 -4.2,-2.25; 4 4.2,-2.25; 5 4.2,0
SJ = smd 1.168 x 1.6: 1 -0.762,0; 2 0.762,0
SUPER-SOT3 = smd 1 x 1.4: 1 -0.95,-1.1; 2 0.95,-1.1; 3 0,1.1
TESTPLUG2MM = drill 1.321 square: A -5.08,0; B 5.08,0
B2,54 = smd 2.54 x 2.54: TP 0,0
PCIE-036-02-F-D-EMS2 = smd 4 x 0.75 bottom: A1 2,-9.695; A2 2,-8.695; A3 2,-7.695; A4 2,-6.695; A5 2,-5.695; A6 2,-4.695; A7 2,-3.695; A8 2,-2.695; A9 2,-1.695; A10 2,-0.695; A11 2,0.305; A12 2,3.675; A13 2,4.675; A14 2,5.675; A15 2,6.675; A16 2,7.675; A17 2,8.675; A18 2,9.675 | smd 4 x 0.75: B1 2,-9.695; B2 2,-8.695; B3 2,-7.695; B4 2,-6.695; B5 2,-5.695; B6 2,-4.695; B7 2,-3.695; B8 2,-2.695; B9 2,-1.695; B10 2,-0.695; B11 2,0.305; B12 2,3.675; B13 2,4.675; B14 2,5.675; B15 2,6.675; B16 2,7.675; B17 2,8.675; B18 2,9.675
PCI-E-36_SLOT = smd 0.7 x 4 bottom: A1 0.5,3.75; A2 1.5,3.75; A3 2.5,3.75; A4 3.5,3.75; A5 4.5,3.75; A6 5.5,3.75; A7 6.5,3.75; A8 7.5,3.75; A9 8.5,3.75; A10 9.5,3.75; A11 10.5,3.75; A12 13.5,3.75; A13 14.5,3.75; A14 15.5,3.75; A15 16.5,3.75; A16 17.5,3.75; A17 18.5,3.75; A18 19.5,3.75 | smd 0.7 x 4: B1 0.5,3.75; B2 1.5,3.75; B3 2.5,3.75; B4 3.5,3.75; B5 4.5,3.75; B6 5.5,3.75; B7 6.5,3.75; B8 7.5,3.75; B9 8.5,3.75; B10 9.5,3.75; B11 10.5,3.75; B12 13.5,3.75; B13 14.5,3.75; B14 15.5,3.75; B15 16.5,3.75; B16 17.5,3.75; B17 18.5,3.75; B18 19.5,3.75

### Placement (x,y rotation side)
C1  47.62,31.75 270 top
C2  45.72,31.75 270 top
C3  58.1,30.48 270 top
C4  53.98,35.24 270 top
C5  16.83,8.73 270 top
C6  7.94,8.73 270 top
C7  13.34,3.17 270 top
C8  43.81,20.64 180 top
C9  43.02,22.54 180 top
C10  49.53,30.48 90 top
C11  43.81,26.35 180 top
C12  43.5,28.26 180 top
C13  51.75,30.8 90 top
C14  49.69,16.67 270 top
C15  18.89,39.37 0 top
C16  18.89,31.11 0 top
C17  18.89,41.27 180 top
C18  18.89,29.21 180 top
C19  24.61,39.37 180 top
C20  23.65,25.08 180 top
C21  28.57,3.17 180 top
C22  19.21,17.78 180 top
C23  78.11,53.98 180 top
C24  78.11,52.07 180 top
C25  36.83,13.65 270 top
C26  34.77,13.49 270 top
C27  44.29,14.61 270 top
C28  46.35,14.13 270 top
C29  32.54,13.49 270 top
C30  45.56,42.7 0 top
IC1  50.48,22.86 270 top
IC2  12.7,8.73 0 top
IC3  24.61,35.56 270 top
IC4  19.21,21.27 270 top
IC5  81.76,52.7 0 top
IC6  40.48,13.02 270 top
IC7  28.57,6.99 90 top
IC8  45.56,46.2 90 top
JP1  82.23,36.51 90 top
JP2  8.57,27.78 270 top
JP3  6.03,27.78 270 top
JP4  62.8,13.8 0 top
JP5  62.8,36.66 0 top
PCB1  0,0 0 top
Q1  55.24,30.48 90 top
Q2  47.31,28.57 180 top
R1  13.49,14.45 90 top
R2  19.05,8.73 90 top
R3  21.91,8.73 90 top
R4  11.11,3.17 90 top
R5  19.68,3.17 270 top
R6  21.91,3.17 270 top
R7  71.27,8.73 270 top
R8  43.81,24.45 180 top
R9  43.81,18.73 180 top
R10  18.89,34.92 180 top
R11  18.89,37.47 180 top
R12  18.89,33.02 180 top
R13  15.4,39.37 0 top
R14  15.4,31.11 0 top
R15  15.4,29.21 0 top
R16  15.4,41.27 0 top
R17  13.49,20.64 270 top
R18  11.59,20.64 270 top
R19  13.49,24.29 270 top
R20  19.53,25.08 0 top
R21  24.92,21.91 90 top
R22  29.05,20.64 90 top
R23  27.15,20.64 270 top
R24  55.4,16.67 270 top
R25  10,47.94 180 top
R26  10,45.88 180 top
R27  40.16,45.09 270 top
S1  77.67,14.05 0 top
S2  77.67,6.75 0 top
SJ1  17.14,47.31 180 top
SJ2  17.14,45.4 0 top
SJ3  52.7,47.47 270 top
SJ4  55.24,47.47 270 top
SJ5  8.57,33.34 270 top
SJ6  6.03,33.34 270 top
SJ7  11.11,33.34 270 top
T1  16.51,3.17 90 top
T2  17.14,14.45 270 top
TP1  29,73.5 90 top
TP2  38,73.5 90 top
TP3  47,73.5 90 top
TP4  56,73.5 90 top
TP5  11,73.5 90 top
TP6  20,73.5 90 top
TP7  2,73.5 90 top
TP8  45.24,5.08 90 top
TP9  37.15,47.78 0 top
TP10  37.15,44.45 0 top
X1  0,29.21 0 top
X2  73,58.5 90 top

### Tracks (layer width: path | path; a pad name or v marks a point on that pad's centre or on a via)
+3V3  (via drill 0.3)
  Top 0.152: IC1.H15 50.48,19.21 49.69,18.41 C14.1
  Top 0.203: IC1.D2 52.48,25.18 v52.39,25.08 | v52.23,27.46 52.23,28.89 51.75,29.37 C13.1 | IC1.P4 47.96,25.04 v48.6,24.92 | v46.04,27.3 45.85,27.3 C12.1 | IC1.H6 50.48,23.3 v50.84,22.95 | C14.1 50.32,17.62 v50.84,17.13 | R7.2 v71.27,6.19 | R6.2 v24.13,2.23 v24.13,2.22 | C6.1 | IC3.8 27.21,37.72 C19.1 26.83,39.37 v27.15,39.69 | R18.2 R17.2 13.49,17.78 11.75,16.03 v11.11,16.03 | IC4.8 v19.84,23.18 | R22.2 v29.05,22.86 | R24.2 v56.52,15.72 | R26.2 R25.2 9.05,50.55 PCB1.1 | C23.1 79.12,53.91 IC5.8 80.56,54.86 v80.49,54.93 | C24.1 79.29,52.3 IC5.6 81.83,52.3 v81.92,52.39 82.63,53.1 IC5.2 | v29.53,1.27 29.53,3.02 C21.1 29.53,4.45 30.16,5.08 IC7.1 | C22.1 v21.27,17.78 | IC7.6 v27.62,7.62 | IC6.1 43.95,15.89 C27.1 46.33,15.55 C28.1 46.96,15.85 v47.47,16.35 | IC6.6 39.18,15.05 38.73,14.6 C25.1 36.54,14.89 C26.1 v34.77,13.65 | IC6.8 37.96,10.14 v37.94,10.16 | R27.2 42.8,44.13 IC8.8 44.55,42.7 | C30.1 44.55,42.7 | 44.55,42.7 43.81,42.7 v43.18,42.07
  Top 0.813: C6.1 8.41,9.53 v9.21,9.53 11.75,9.53 12.06,9.84 IC2.7 12.06,12.7 v11.59,13.18
  Bottom 0.203: v19.84,23.18 19.84,19.21 v21.27,17.78 21.27,15.88 | X1.A2 4.57,20.52 5.24,19.84 5.24,15.72 | v27.15,39.69 30.8,39.69 | v52.23,27.46 53.18,27.46 | v29.05,22.86 30.16,22.86 30.64,22.38
  Bottom 0.61: v52.39,25.08 52.23,25.24 v52.23,27.46 | v48.6,24.92 46.04,26.99 v46.04,27.3
  pour Bottom: 0,0 85,0 85,56 0,56 0,42.86 30.32,42.86 30.48,16.51 0.16,16.51
+5V  (via drill 0.3)
  Top 0.203: v4.6,19.53 v7.3,19.53
  Bottom 0.203: X1.A1 4.28,19.52 v4.6,19.53 | v7.3,19.53 7.3,21.91 9.84,24.45 9.84,25.56 12.7,28.26 12.7,34.61 6.99,40.16 6.99,52.38 PCB1.2 PCB1.4 11.54,53.77 13.02,55.24 57.15,55.24 58.1,54.29 58.1,49.85 65.09,42.86 JP1.7
AE
  Top 0.203: X1.B7 3.92,25.52 5.24,26.83 5.24,26.99 JP3.2
AE_BIO
  Top 0.203: SJ6.2 JP3.1 6.51,30.32 7.78,29.05 13.18,29.05 13.34,28.89 13.34,28.42 13.65,28.1 15.24,28.1 15.4,28.26 15.4,40.96 15.08,41.27 R16.1
AE_E
  Top 0.152: 58.85,64.48 32.94,64.48 TP1.A
  Top 0.203: X2.B7 59.34,65 58.85,64.48 | X2.B15 32.58,75 TP1.B
  Bottom 0.203: TP1.B TP1.A
AE_SENS  (via drill 0.3)
  Top 0.203: X1.B15 5.71,35.88 6.03,35.88 | 6.03,35.88 SJ6.1 | 6.03,35.88 v7.3,35.88 | v9.37,35.88 13.34,35.88 14.45,36.99 R13.1
  Bottom 0.203: v7.3,35.88 v9.37,35.88
AFE1  (via drill 0.3)
  Top 0.203: JP3.3 7.3,26.51 10.95,26.51 11.11,26.67 25.72,26.67 v25.88,26.83 | IC1.R6 46.14,23.98 v45.89,24.05
  Bottom 0.203: v25.88,26.83 26.19,26.51 29.84,26.51 33.5,22.86 44.45,22.86 45.56,23.97 v45.89,24.05
AFE3  (via drill 0.3)
  Top 0.152: IC1.R7 46.22,23.36 v46.12,23.32
  Top 0.203: JP2.3 9.37,26.04 11.11,26.04 11.27,26.19 25.4,26.19 25.56,26.04 26.67,26.04 v26.99,25.72
  Bottom 0.203: v26.99,25.72 27.3,26.04 29.53,26.04 33.18,22.38 44.61,22.38 45.56,23.32 v46.12,23.32
AFE7  (via drill 0.3)
  Top 0.152: IC1.R9 46.54,22.36
  Top 0.203: C18.1 24.61,29.21 v28.89,24.92 | 46.54,22.36 v46.31,22.14
  Bottom 0.203: v46.31,22.14 45.24,21.11 42.39,21.11 42.07,21.43 32.38,21.43 v28.89,24.92
AFE8  (via drill 0.3)
  Top 0.152: IC1.P9 47.57,22.36 47.85,22.46 48.29,22.37 48.63,22.05 v48.85,21.74
  Top 0.203: C17.1 26.67,41.27 32.7,35.24 32.7,24.13 33.18,23.65 v33.97,23.65
  Bottom 0.152: v48.85,21.74 48.6,22.08 48.29,22.38 47.81,22.46 47.5,22.29 46.68,23.14 46.69,24.15 46.23,24.61 45.56,24.61 45.38,24.43
  Bottom 0.203: 45.38,24.43 44.61,23.65 v33.97,23.65
AGND  (via drill 0.3)
  Bottom 0.203: X2.A16 67.35,76 66.52,76.83 | 66.52,76.83 v66.5,76.95 | X2.B14 v66.5,74 | X2.B10 v66.5,68 | 66.52,76.83 66.52,73.98
  pour Top: 0,58.5 73,58.5 73,78.5 0,78.5
  pour Bottom: 0,58.58 73.03,58.58 73.03,78.42 0.16,78.42
AN_A  (via drill 0.3)
  Top 0.152: IC1.P12 48.04,20.86 v48.1,20.8
  Top 0.203: IC3.7 28.89,36.2 32.23,32.86 32.23,23.18 32.86,22.54 33.18,22.54 v35.4,20.32
  Bottom 0.152: v48.1,20.8 47.17,20.8 46.04,19.68
  Bottom 0.203: 46.04,19.68 42.23,19.68 41.59,20.32 v35.4,20.32
AN_D  (via drill 0.3)
  Top 0.152: IC1.R14 46.53,19.86
  Top 0.203: IC4.7 23.34,21.91 24.29,22.86 R21.2 26.51,22.86 27.46,23.81 29.05,23.81 35.88,16.99 v39.69,16.99 | 46.53,19.86 46.04,19.37 v46.04,16.99
  Bottom 0.203: v46.04,16.99 v39.69,16.99
BOOT  (via drill 0.3)
  Top 0.152: IC1.N2 47.98,25.68 48.19,25.47 48.82,25.47 v49.35,25.25
  Top 0.203: S1.2 S1.1 73.44,16.27 71.64,16.27 v71.32,16.59 | SJ4.2 55.24,43.66 56.99,41.91 60.8,41.91 65.41,37.31 v65.41,22.38
  Bottom 0.203: v49.35,25.25 49.67,24.92 50.14,24.44 63.46,24.45 65.41,22.5 v65.41,22.38 71.2,16.59 v71.32,16.59
DBUG_RX  (via drill 0.3)
  Top 0.152: IC1.J2 49.98,25.42 v50.16,25.24
  Bottom 0.203: v50.16,25.24 51.17,26.25 51.17,28 51.75,28.57 70.48,28.57 JP1.6
DBUG_TX  (via drill 0.3)
  Top 0.152: IC1.J1 49.98,28.07
  Top 0.203: 49.98,28.07 v50.16,28.26 | v74.77,35.24 JP1.4
  Bottom 0.203: v50.16,28.26 50.16,29.84 51.28,30.96 70.48,30.96 v74.77,35.24
DETECT  (via drill 0.3)
  Top 0.203: IC1.A15 54.62,19.36 55.4,18.57 | 55.4,18.57 R24.1 | v62.23,32.86 62.23,21.75 59.69,19.21 56.04,19.21 55.4,18.57 | X1.B14 4.56,34.88 v4.92,35.24 | v14.45,35.08 v9.84,35.08
  Bottom 0.203: v14.45,35.08 14.45,38.58 16.51,40.64 59.53,40.64 62.87,37.31 62.87,33.5 v62.23,32.86 | v4.92,35.24 5.08,35.08 v9.84,35.08
GE
  Top 0.203: X1.B9 4.02,27.52 4.76,28.26 4.76,28.73 5.08,29.05 6.83,29.05 8.1,27.78 JP2.2
GE_BIO
  Top 0.203: SJ5.2 JP2.1 13.34,30.32 R15.1
GE_E
  Top 0.152: 57.53,66.75 48.66,66.75 TP3.A
  Top 0.203: X2.B9 57.78,67 57.53,66.75 | X2.B16 49.58,76 TP3.B
  Bottom 0.203: TP3.B TP3.A
GE_SENS
  Top 0.203: X1.B16 7.41,36.88 8.57,35.72 SJ5.1 SJ7.1 13.53,34.1 14.45,33.18 R14.1
GND  (via drill 0.3)
  Bottom 0.203: v30.64,28.89 29.37,28.89 | X1.A5 4.27,23.52 6.67,21.11 6.67,16.83 v7.46,16.03
  Bottom 0.61: v52.07,23.34 v52.7,23.34 v55.09,23.34 | v55.09,23.34 v55.09,22.7 | v55.09,23.34 v55.72,23.34
  Bottom 0.813: v55.09,9.53 v55.09,10.16 v55.09,10.79 v50.01,10.79 v49.53,10.32
  pour Top: 0,0 85,0 85,56 0,56 0,42.86 30.32,42.86 30.48,16.51 0.16,16.51
GNDA  (via drill 0.3)
  Top 0.127: IC1.P14 47.88,20.25
  Top 0.152: 47.88,20.25 49.13,20.25 49.48,20.6 IC1.K10
  Top 0.203: IC1.K10 IC1.K9 49.98,22.36 v50.14,22.46
  Bottom 0.152: 46.33,25.31 46.47,25.31 47.42,24.33 47.42,24.05 47.81,23.71 48.92,23.89 49.97,22.85 v50.14,22.46
  Bottom 0.203: 46.33,25.31 44.79,25.32 44.72,25.25 42.39,25.25 41.91,24.77 33.18,24.77 30.16,27.94 28.89,27.94
  other vias: 8.73,40.8 7.78,41.59 8.73,41.59 9.68,41.59 10.64,41.59 11.59,41.59 10.64,40.8 9.68,40.8 10,19.37 29.37,28.89 10,22.86 26.19,23.81 10.48,25.08 2.06,31.27 5.71,37.94
  pour Top: 0.16,17.14 0,42.23 29.69,42.23 29.84,17.14
  pour Bottom: 0.16,17.14 0,42.23 29.69,42.23 29.84,17.14
GPIO0
  Top 0.203: IC1.A13 59.09,20.36 60.96,22.23 60.96,34.61 58.99,36.58 JP5.2
GPIO1
  Top 0.203: IC1.A14 59.39,19.86 61.53,22 JP5.3
H1  (via drill 0.3)
  Top 0.203: X1.B5 10.3,23.52 v10.64,23.81 | v19.68,14.45 T2.3
  Bottom 0.203: v10.64,23.81 14.13,23.81 16.99,20.95 16.99,15.08 17.62,14.45 v19.68,14.45
HF1
  Top 0.152: IC1.D1 52.48,26.77
  Top 0.203: 52.48,26.77 53.02,27.3 53.02,31.62 Q1.3 53.98,32.5 C4.2
HF2
  Top 0.152: IC1.C1 52.98,26.63
  Top 0.203: 52.98,26.63 53.66,27.3 55.12,27.3 Q1.1 57.34,29.53 C3.2
HZ_EN
  Top 0.203: R5.1 R6.1
I_SOLL  (via drill 0.3)
  Top 0.203: R4.1 v9.53,2.23 v9.53,2.22 | IC7.8 23.81,5.08 v23.81,5.24
  Bottom 0.203: v9.53,2.22 9.53,4.29 10.48,5.24 v23.81,5.24
MOSI
  Top 0.152: IC1.F15 51.48,17.41
  Top 0.203: IC7.4 32.38,8.89 33.02,8.26 39.85,8.26 | 39.85,8.26 49.21,8.26 51.48,10.53 51.48,17.41 | IC6.10 39.83,8.27 39.85,8.26
N$1
  Top 0.203: R1.1 13.34,13.34 IC2.6 13.34,10 13.65,9.68 C5.1
N$2
  Top 0.203: R2.1 C5.2 12.38,7.78 12.06,7.46 IC2.2
N$3  (via drill 0.3)
  Top 0.152: IC1.J10 49.98,21.56 50.05,21.47 v50.05,21.13
  Top 0.203: v40.01,18.89 40.01,19.37 37.62,21.75 37.62,37.78 v28.1,47.31 | v18.41,48.9 18.41,47.82 SJ1.1
  Bottom 0.152: v50.05,21.13 47.02,18.1 46.83,18.1
  Bottom 0.203: 46.83,18.1 40.32,18.1 40.01,18.41 v40.01,18.89 | v28.1,47.31 20,47.31 v18.41,48.9
N$4  (via drill 0.3)
  Top 0.152: IC1.G15 50.98,18.87
  Top 0.203: 50.98,18.87 v50.8,18.73 | v39.05,19.05 37.15,20.95 37.15,37.47 30.48,44.13 17.14,44.13 16.51,44.77 16.51,45.28 SJ2.1
  Bottom 0.203: v50.8,18.73 48.26,18.73 47.15,17.62 40.16,17.62 39.05,18.73 v39.05,19.05
N$5
  Top 0.203: T2.1 R1.2
N$6
  Top 0.203: R3.2 18.54,13.5 T2.2 16.05,13.01 19.05,10 R2.2
N$7
  Top 0.203: C7.1 R4.2 | IC2.3 C7.1 | C7.1 14.46,4.12 T1.3
N$8
  Top 0.203: T1.1 R5.2
N$9
  Top 0.203: S1.4 S1.3 72.44,11.8 71.28,10.64 R7.1
N$10
  Top 0.203: IC6.7 37.77,15.89 37.15,16.51 32.86,16.51 32.54,16.19 C29.1
N$11  (via drill 0.3)
  Top 0.152: IC1.P5 47.86,24.37 v48.01,24.35
  Top 0.203: R8.2 42.7,24.45 v41.59,25.56
  Bottom 0.152: 46.41,25.72 46.5,25.72 47.85,24.47 v48.01,24.35
  Bottom 0.203: v41.59,25.56 41.75,25.72 46.41,25.72
N$12
  Top 0.152: IC1.R5 46.44,24.36 46.2,24.61 44.93,24.61 44.85,24.36
  Top 0.203: 44.85,24.36 R8.1
N$13  (via drill 0.3)
  Top 0.152: IC1.P11 48.39,21.33 v48.9,20.95
  Top 0.203: R9.2 v41.59,18.73 40.48,17.62 IC6.4
  Bottom 0.152: v48.9,20.95 48.9,20.64 47.47,19.21
  Bottom 0.203: 47.47,19.21 42.07,19.21 v41.59,18.73
N$14
  Top 0.152: IC1.R11 46.92,21.36 46.51,20.95
  Top 0.203: 46.51,20.95 46.51,20.48 45.4,19.37 R9.1 44.77,17.94 44.29,17.46 41.43,17.46 41.13,17.16 IC6.3
N$15
  Top 0.203: IC3.2 18.57,36.2 17.94,35.56 R10.2
N$16
  Top 0.152: IC1.R10 46.78,21.86 46.51,21.59 45.56,21.59 45.4,21.75 44.77,21.75 44.66,21.86 44.63,21.86
  Top 0.203: 44.63,21.86 C9.1
N$17
  Top 0.203: R15.2 C18.2
N$18
  Top 0.152: IC1.K1 49.48,29.48
  Top 0.203: 49.48,29.48 C10.1
N$19
  Top 0.152: IC1.R4 46.58,24.86
  Top 0.203: 46.58,24.86 45.72,25.72 45.72,26.04 45.4,26.35 C11.1
N$20
  Top 0.203: IC3.3 R10.1
N$21
  Top 0.203: IC3.1 R11.1 C15.2
N$22
  Top 0.203: IC3.4 19.84,33.66 R12.1 C16.2
N$23
  Top 0.203: C16.1 R14.2
N$24
  Top 0.203: C15.1 R13.2
N$25
  Top 0.203: SJ4.1 55.24,52.38 PCB1.40
N$26
  Top 0.203: C17.2 R16.2
N$27
  Top 0.203: R19.2 R17.1 14.13,21.59 15.08,20.64 IC4.3
N$28
  Top 0.203: SJ3.1 52.7,52.38 PCB1.38
N$29
  Top 0.203: C20.2 R20.2 18.57,23.18 18.57,20.95 18.89,20.64 IC4.6 24.6,20.64 R21.1
N$30
  Top 0.203: IC4.5 26.83,19.37 R23.2 R22.1
N$31
  Top 0.203: PCB1.27 41.39,49.67 IC8.5
N$32
  Top 0.203: IC8.6 44.61,46.83 44.93,47.15 44.93,48.74 43.97,49.69 43.34,49.69 42.7,50.32 42.7,52.46 PCB1.28
N$33
  Top 0.203: IC8.7 40.64,45.56 R27.1 38.9,46.03 TP9.TP
PCS
  Top 0.203: IC1.K15 49.48,19 49.21,18.73 48.74,18.73 48.58,18.57 48.58,11.59 48.42,11.43 41.43,11.43 41.13,11.13 IC6.12
RE1  (via drill 0.3)
  Top 0.152: IC1.R8 45.94,22.75 v45.7,22.61
  Top 0.203: X1.B8 4.13,26.52 v4.6,26.99 | v10.64,27.15 24.77,27.15 v24.92,27.3 | SJ7.2 v11.11,31.27
  Bottom 0.203: v4.6,26.99 5.08,26.51 10,26.51 v10.64,27.15 11.43,27.94 11.43,28.42 11.11,28.73 v11.11,31.27 | v45.7,22.61 44.93,21.91 33.02,21.91 29.37,25.56 27.94,25.56 27.3,24.92 26.04,24.92 25.08,25.88 25.08,26.99 v24.92,27.3
RE1_E
  Top 0.152: 58.85,65.12 41.3,65.12 TP2.A
  Top 0.203: X2.B8 59.97,66 58.85,65.12
  Bottom 0.203: TP2.B TP2.A
RE2  (via drill 0.3)
  Top 0.152: IC1.P8 48.5,22.68 48.48,22.68 v48.88,22.57
  Top 0.203: X1.B11 1.57,29.67 v3.49,31.59 | v10.64,28.1 11.11,27.62 23.81,27.62 v24.13,27.94
  Bottom 0.152: v48.88,22.57 47.77,22.82 47.07,23.71 47.07,24.24 46.39,24.92 45.25,24.92 45.13,24.81
  Bottom 0.203: v3.49,31.59 9.53,31.59 9.84,31.27 9.84,28.89 v10.64,28.1 | 45.13,24.81 44.61,24.29 32.7,24.29 30,26.99 26.83,26.99 25.88,27.94 v24.13,27.94
RE2_E
  Top 0.203: X2.B11 56.58,69 TP4.A
  Bottom 0.203: TP4.B TP4.A
RE3  (via drill 0.3)
  Top 0.152: IC1.P7 48.08,23.36 v48.49,23.25
  Top 0.203: v53.98,13.18 53.98,8.73 TP8.A
  Bottom 0.152: v48.49,23.25 49.05,23.18 49.49,22.74 49.49,22.26 49.85,21.91 50.96,21.91 51.28,22.23 53.18,22.23 54.13,21.27 54.13,13.49 v53.98,13.18
  Bottom 0.203: TP8.B TP8.A
RST  (via drill 0.3)
  Top 0.152: IC1.K8 49.1,23.15 49.09,24.08 v49.3,24.47
  Top 0.203: S2.4 81.84,4.53 v77.67,4.53 73.5,4.53 S2.3 | SJ3.2 52.7,43.66 55.56,40.8 59.85,40.8 62.87,37.78 v62.87,23.81
  Bottom 0.152: v49.3,24.47 49.82,23.95
  Bottom 0.203: 77.55,15.25 77.47,22.86 JP1.1 | 77.55,15.25 v77.67,4.53 77.67,4.5 | 49.82,23.95 62.73,23.95 v62.87,23.81 71.44,15.24 77.55,15.24 77.55,15.25
RTC1
  Top 0.152: IC1.P1 47.48,27.55
  Top 0.203: 47.48,27.55 Q2.2 46.46,30.06 C2.2
RTC2
  Top 0.152: IC1.N1 47.98,28.4
  Top 0.203: 47.98,28.4 Q2.1 48.16,30.27 C1.2
RX
  Top 0.203: PCB1.8 14.61,52.39 14.61,48.26 15.56,47.31 SJ1.2
SCL  (via drill 0.3)
  Top 0.152: IC1.G10 50.98,21.73 51.44,21.27 v51.56,21.23
  Top 0.203: PCB1.5 13.45,48.38 R26.1 13.17,43.66 30.16,43.66 36.67,37.15 36.67,19.68 v37.15,19.21 | IC5.4 82.96,51.03 83.34,50.64 83.34,48.58 82.39,47.62 75.41,47.62 72.07,44.29 72.07,26.88 JP4.2
  Bottom 0.152: v51.56,21.23 51.56,20.86 52.7,19.68 52.7,16.67
  Bottom 0.203: X1.A4 4.16,22.52 6.19,20.48 6.19,13.81 7.46,12.54 34.92,12.54 35.56,13.18 35.56,18.73 36.04,19.21 v37.15,19.21 37.15,13.65 38.26,12.54 51.75,12.54 | 51.75,12.54 57.73,12.54 JP4.2 | 52.7,16.67 51.75,15.72 51.75,12.54
SCLK  (via drill 0.3)
  Top 0.152: IC1.F14 51.48,19.91 51.76,20.24 52.61,20.24 52.84,20.48 v52.86,20.48
  Top 0.203: IC7.3 32.7,7.62 32.86,7.78 40.16,7.78 v40.48,7.46 40.8,7.78 49.53,7.78 52.39,10.64 v52.39,13.97 | IC6.11 v40.48,9.05
  Bottom 0.152: v52.86,20.48 53.18,20.16 53.18,16.51 52.23,15.56 52.23,14.13 v52.39,13.97
  Bottom 0.203: v40.48,9.05 v40.48,7.46
SCS  (via drill 0.3)
  Top 0.152: IC1.F10 51.97,21.86 v52.29,21.52
  Top 0.203: IC7.2 32.38,6.35 33.34,7.3 39.69,7.3 40.16,6.83 40.8,6.83 41.27,7.3 49.85,7.3 53.02,10.48 v53.02,15.08
  Bottom 0.152: v52.29,21.52 52.75,21.52 53.66,20.64 53.66,15.72 v53.02,15.08
SDA  (via drill 0.3)
  Top 0.152: IC1.H10 50.48,21.59 50.82,21.25 v50.82,21.02
  Top 0.203: PCB1.3 10.91,47.98 R25.1 10.32,47.94 10,47.62 10,43.97 10.79,43.18 29.84,43.18 36.2,36.83 v36.2,18.1 | IC5.3 83.43,52.3 83.82,51.91 83.82,48.42 82.55,47.15 75.72,47.15 72.55,43.97 72.55,26.67 61.53,15.65 JP4.3 59.8,12.06 56.52,12.06 54.13,14.45 54.13,15.56 52.07,17.62 v52.07,18.57
  Bottom 0.152: v50.82,21.02 50.81,19.86 v52.07,18.57
  Bottom 0.203: X1.A3 4.36,21.52 5.71,20.16 5.71,13.65 7.3,12.06 36.2,12.06 | 36.2,12.06 59.8,12.06 JP4.3 | v36.2,18.1 36.2,12.06
SWCLK  (via drill 0.3)
  Top 0.152: IC1.H2 50.48,25.72 50.96,25.24 v51.12,25.24
  Bottom 0.203: v51.12,25.24 51.59,25.72 51.59,27.78 51.91,28.1 70.64,28.1 80.33,37.78 JP1.5
SWIO  (via drill 0.3)
  Top 0.152: IC1.H1 50.48,27.3
  Top 0.203: 50.48,27.3 v50.54,27.34 | v73.5,32.7 JP1.3
  Bottom 0.203: v50.54,27.34 50.8,27.62 50.8,29.84 51.44,30.48 71.28,30.48 v73.5,32.7
T1
  Top 0.203: X1.B2 10.2,20.52 10.95,21.27 11.27,21.27 R18.1 12.22,21.59 12.22,23.97 12.54,24.29 14.45,24.29 14.76,23.97 14.76,22.23 15.08,21.91 IC4.2
T1_E
  Top 0.152: 60.99,60.44 58.22,63.22 16.2,63.22 TP5.A
  Top 0.203: X2.B2 61.43,60 60.99,60.44
  Bottom 0.203: TP5.B TP5.A
T2  (via drill 0.3)
  Top 0.203: R20.1 17.62,25.08 v16.99,24.45 16.61,24.07 IC4.1 | X1.B3 9.93,21.52 10.32,21.91 10.32,22.23 11.59,23.5 11.59,25.08 v11.91,25.4
  Bottom 0.203: v11.91,25.4 16.03,25.4 v16.99,24.45
T2_E
  Top 0.152: 60.94,61.44 58.53,63.85 24.57,63.85 TP6.A
  Top 0.203: X2.B3 61.38,61 60.94,61.44
  Bottom 0.203: TP6.B TP6.A
TX
  Top 0.203: SJ2.2 19.05,45.4 20,46.35 20,52.3 PCB1.10
V+  (via drill 0.3)
  Top 0.203: IC3.6 v29.05,34.92 31.75,32.23 31.75,22.86 v33.81,20.8 | C8.1 v45.72,20.64 | IC1.P10 47.97,21.86 v47.98,21.89 | R11.2 v16.67,37.47 | R12.2 v16.67,33.02
  Bottom 0.203: v47.98,21.89 46.96,21.88 v45.72,20.64 42.23,20.64 41.91,20.95 33.97,20.95 v33.81,20.8 | v16.67,37.47 26.51,37.47 v29.05,34.92 27.46,33.02 v16.67,33.02

### Text on the board
tStop: GND | T1 | T2 | AE | RE1 | GE | RE2 | FABLAB MÜNCHEN | CitizenSensor | V1.1 | GH | FABLAB MÜNCHEN | CitizenSensor | V1.1 | GH | SER BOOT | RESET
tCream: GH | 2018/04 | FABLAB MÜNCHEN | FABLAB MÜNCHEN | GH | V1 | 2018/04